# EAGLE schematic PX4FMUlite_V0_4 (EAGLE 6.5.0)

## Sheet 1 of 12
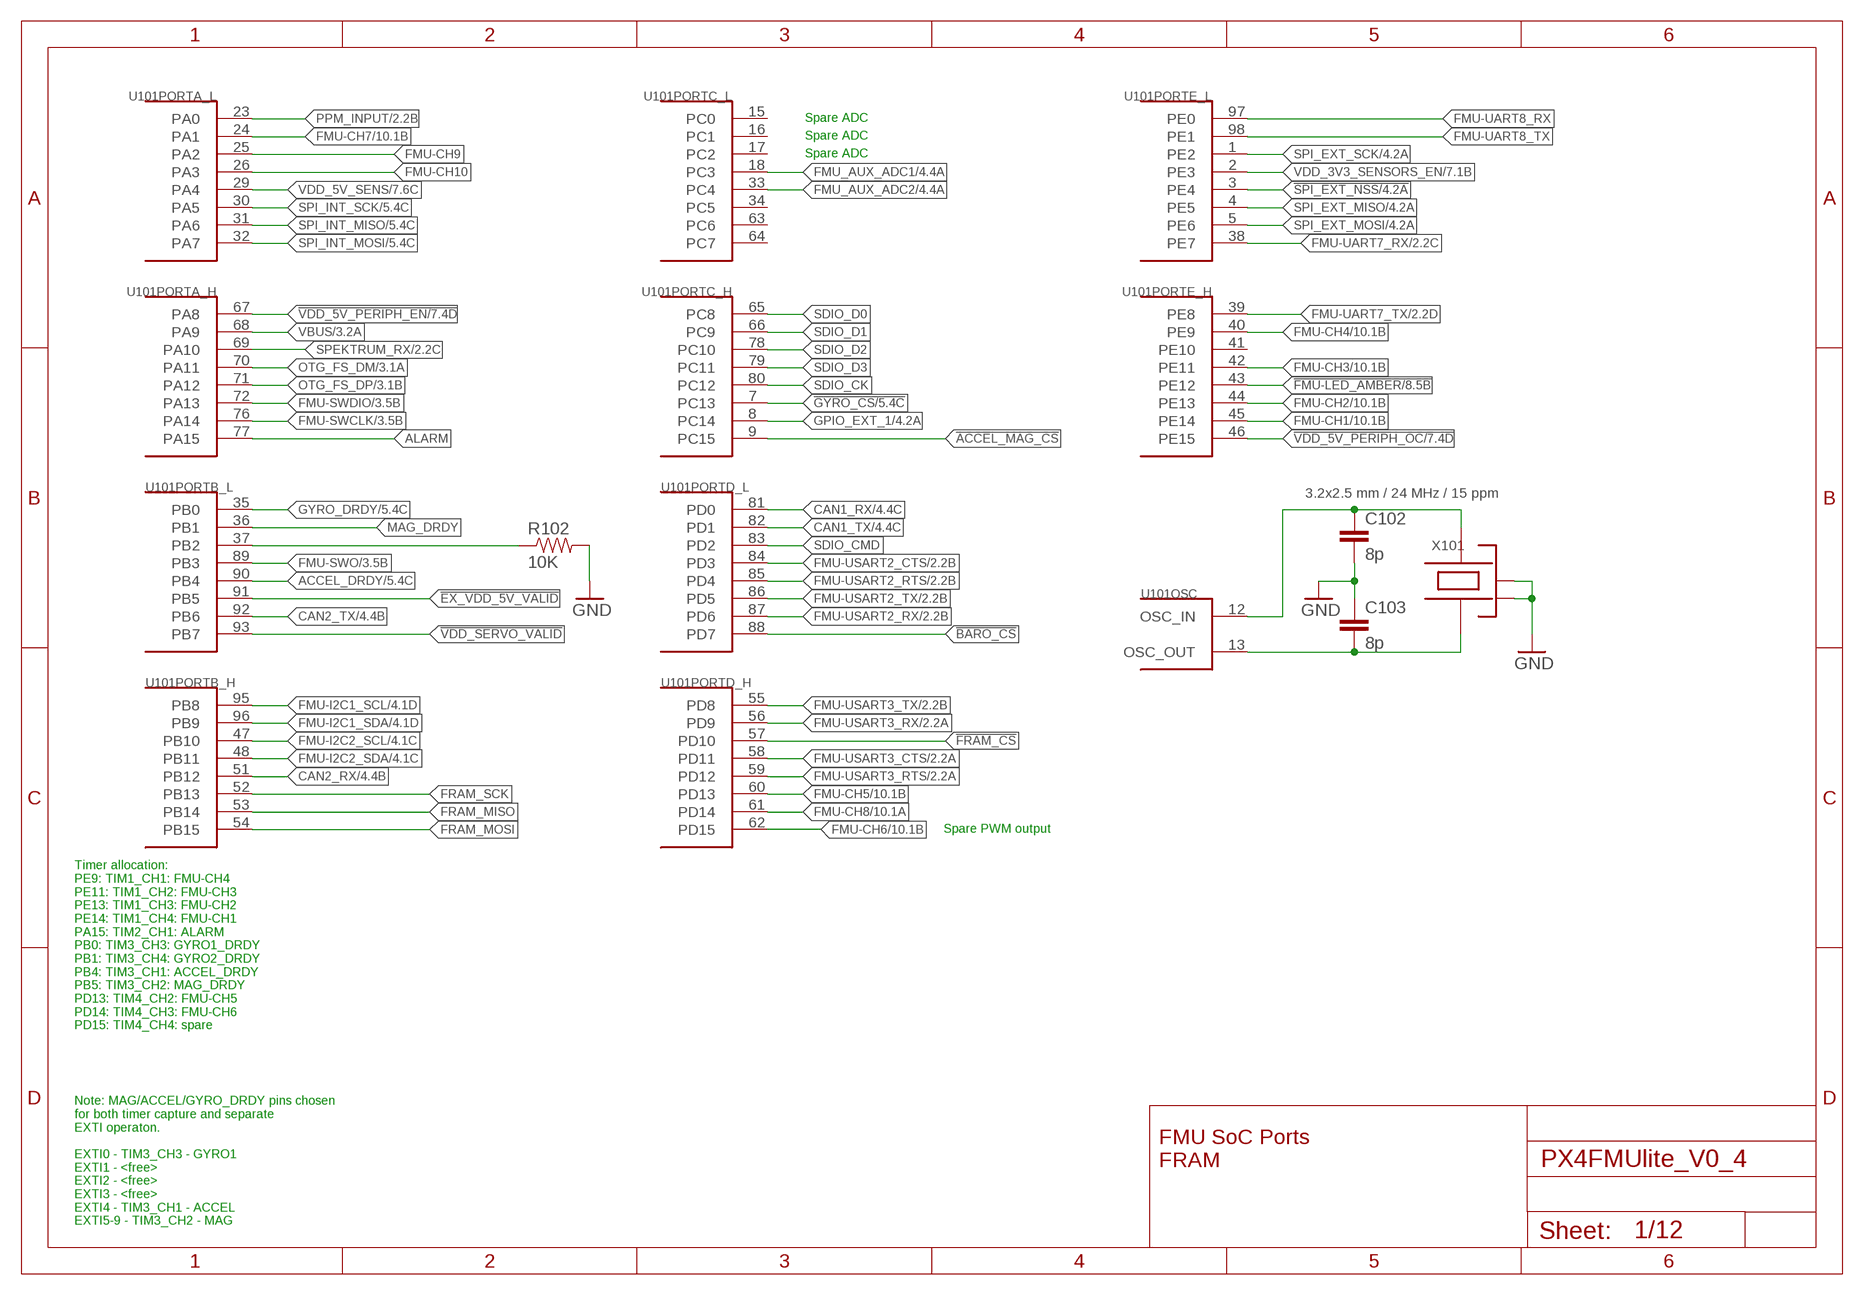
[diagram p0: schematic, sheet 1]

### Parts
C102  8p  CAP0402  [0402-CAP]
C103  8p  CAP0402  [0402-CAP]
R102  10K  RESISTOR0402-RES  [0402-RES]
U101  STM32F4X7VX  [TQFP100]
X101  3.2x2.5 mm / 24 MHz / 15 ppm  OSCILLATOR-3.2X2.5  [OSCILLATOR-3.2X2.5]

### Nets
!ACCEL_MAG_CS: U101.9(PORTC_H:PC15)
!BARO_CS: U101.88(PORTD_L:PD7)
!EX_VDD_5V_VALID: U101.91(PORTB_L:PB5)
!FMU-LED_AMBER: U101.43(PORTE_H:PE12) ; also sheet 8
!FRAM_CS: U101.57(PORTD_H:PD10)
!GYRO_CS: U101.7(PORTC_H:PC13) ; also sheet 5
!SPI_EXT_NSS: U101.3(PORTE_L:PE4) ; also sheet 4
!VDD_5V_PERIPH_EN: U101.67(PORTA_H:PA8) ; also sheet 7
!VDD_5V_PERIPH_OC: U101.46(PORTE_H:PE15) ; also sheet 7
!VDD_SERVO_VALID: U101.93(PORTB_L:PB7)
ACCEL_DRDY: U101.90(PORTB_L:PB4) ; also sheet 5
ALARM: U101.77(PORTA_H:PA15)
CAN1_RX: U101.81(PORTD_L:PD0) ; also sheet 4
CAN1_TX: U101.82(PORTD_L:PD1) ; also sheet 4
CAN2_RX: U101.51(PORTB_H:PB12) ; also sheet 4
CAN2_TX: U101.92(PORTB_L:PB6) ; also sheet 4
FMU-CH1: U101.45(PORTE_H:PE14) ; also sheet 10
FMU-CH2: U101.44(PORTE_H:PE13) ; also sheet 10
FMU-CH3: U101.42(PORTE_H:PE11) ; also sheet 10
FMU-CH4: U101.40(PORTE_H:PE9) ; also sheet 10
FMU-CH5: U101.60(PORTD_H:PD13) ; also sheet 10
FMU-CH6: U101.62(PORTD_H:PD15) ; also sheet 10
FMU-CH7: U101.24(PORTA_L:PA1) ; also sheet 10
FMU-CH8: U101.61(PORTD_H:PD14) ; also sheet 10
FMU-CH9: U101.25(PORTA_L:PA2)
FMU-CH10: U101.26(PORTA_L:PA3)
FMU-I2C1_SCL: U101.95(PORTB_H:PB8) ; also sheet 4
FMU-I2C1_SDA: U101.96(PORTB_H:PB9) ; also sheet 4
FMU-I2C2_SCL: U101.47(PORTB_H:PB10) ; also sheet 4
FMU-I2C2_SDA: U101.48(PORTB_H:PB11) ; also sheet 4
FMU-SWCLK: U101.76(PORTA_H:PA14) ; also sheet 3
FMU-SWDIO: U101.72(PORTA_H:PA13) ; also sheet 3
FMU-SWO: U101.89(PORTB_L:PB3) ; also sheet 3
FMU-UART7_RX: U101.38(PORTE_L:PE7) ; also sheet 2
FMU-UART7_TX: U101.39(PORTE_H:PE8) ; also sheet 2
FMU-UART8_RX: U101.97(PORTE_L:PE0)
FMU-UART8_TX: U101.98(PORTE_L:PE1)
FMU-USART2_CTS: U101.84(PORTD_L:PD3) ; also sheet 2
FMU-USART2_RTS: U101.85(PORTD_L:PD4) ; also sheet 2
FMU-USART2_RX: U101.87(PORTD_L:PD6) ; also sheet 2
FMU-USART2_TX: U101.86(PORTD_L:PD5) ; also sheet 2
FMU-USART3_CTS: U101.58(PORTD_H:PD11) ; also sheet 2
FMU-USART3_RTS: U101.59(PORTD_H:PD12) ; also sheet 2
FMU-USART3_RX: U101.56(PORTD_H:PD9) ; also sheet 2
FMU-USART3_TX: U101.55(PORTD_H:PD8) ; also sheet 2
FMU_AUX_ADC1: U101.18(PORTC_L:PC3) ; also sheet 4
FMU_AUX_ADC2: U101.33(PORTC_L:PC4) ; also sheet 4
FRAM_MISO: U101.53(PORTB_H:PB14)
FRAM_MOSI: U101.54(PORTB_H:PB15)
FRAM_SCK: U101.52(PORTB_H:PB13)
GND [power]: C102.P$2 C103.P$1 R102.P$2 X101.2(NC_2) X101.4(NC_4) ; also sheet 2,3,4,5,6,7,8,9,10
GPIO_EXT_1: U101.8(PORTC_H:PC14) ; also sheet 4
GYRO_DRDY: U101.35(PORTB_L:PB0) ; also sheet 5
MAG_DRDY: U101.36(PORTB_L:PB1)
N$1: C103.P$2 U101.13(OSC:OSC_OUT) X101.1
N$2: C102.P$1 U101.12(OSC:OSC_IN) X101.3
OTG_FS_DM: U101.70(PORTA_H:PA11) ; also sheet 3
OTG_FS_DP: U101.71(PORTA_H:PA12) ; also sheet 3
PB2-BOOT1: R102.P$1 U101.37(PORTB_L:PB2)
PPM_INPUT: U101.23(PORTA_L:PA0) ; also sheet 2
SDIO_CK: U101.80(PORTC_H:PC12) ; also sheet 3
SDIO_CMD: U101.83(PORTD_L:PD2) ; also sheet 3
SDIO_D0: U101.65(PORTC_H:PC8) ; also sheet 3
SDIO_D1: U101.66(PORTC_H:PC9) ; also sheet 3
SDIO_D2: U101.78(PORTC_H:PC10) ; also sheet 3
SDIO_D3: U101.79(PORTC_H:PC11) ; also sheet 3
SPEKTRUM_RX: U101.69(PORTA_H:PA10) ; also sheet 2
SPI_EXT_MISO: U101.4(PORTE_L:PE5) ; also sheet 4
SPI_EXT_MOSI: U101.5(PORTE_L:PE6) ; also sheet 4
SPI_EXT_SCK: U101.1(PORTE_L:PE2) ; also sheet 4
SPI_INT_MISO: U101.31(PORTA_L:PA6) ; also sheet 5
SPI_INT_MOSI: U101.32(PORTA_L:PA7) ; also sheet 5
SPI_INT_SCK: U101.30(PORTA_L:PA5) ; also sheet 5
VBUS [power]: U101.68(PORTA_H:PA9) ; also sheet 3,9
VDD_3V3_SENSORS_EN: U101.2(PORTE_L:PE3) ; also sheet 7
VDD_5V_SENS: U101.29(PORTA_L:PA4) ; also sheet 7
Unconnected: U101.15(PORTC_L:PC0) U101.16(PORTC_L:PC1) U101.17(PORTC_L:PC2) U101.34(PORTC_L:PC5) U101.41(PORTE_H:PE10) U101.63(PORTC_L:PC6) U101.64(PORTC_L:PC7)

### Notes on the sheet
- Spare ADC
- Spare ADC
- Spare ADC
- Spare PWM output
- Timer allocation:
  PE9: TIM1_CH1: FMU-CH4
  PE11: TIM1_CH2: FMU-CH3
  PE13: TIM1_CH3: FMU-CH2
  PE14: TIM1_CH4: FMU-CH1
  PA15: TIM2_CH1: ALARM
  PB0: TIM3_CH3: GYRO1_DRDY
  PB1: TIM3_CH4: GYRO2_DRDY
  PB4: TIM3_CH1: ACCEL_DRDY
  PB5: TIM3_CH2: MAG_DRDY
  PD13: TIM4_CH2: FMU-CH5
  PD14: TIM4_CH3: FMU-CH6
  PD15: TIM4_CH4: spare
- FMU SoC Ports
  FRAM
- Note: MAG/ACCEL/GYRO_DRDY pins chosen
  for both timer capture and separate
  EXTI operaton.
  
  EXTI0 - TIM3_CH3 - GYRO1
  EXTI1 - <free>
  EXTI2 - <free>
  EXTI3 - <free>
  EXTI4 - TIM3_CH1 - ACCEL
  EXTI5-9 - TIM3_CH2 - MAG

## Sheet 2 of 12
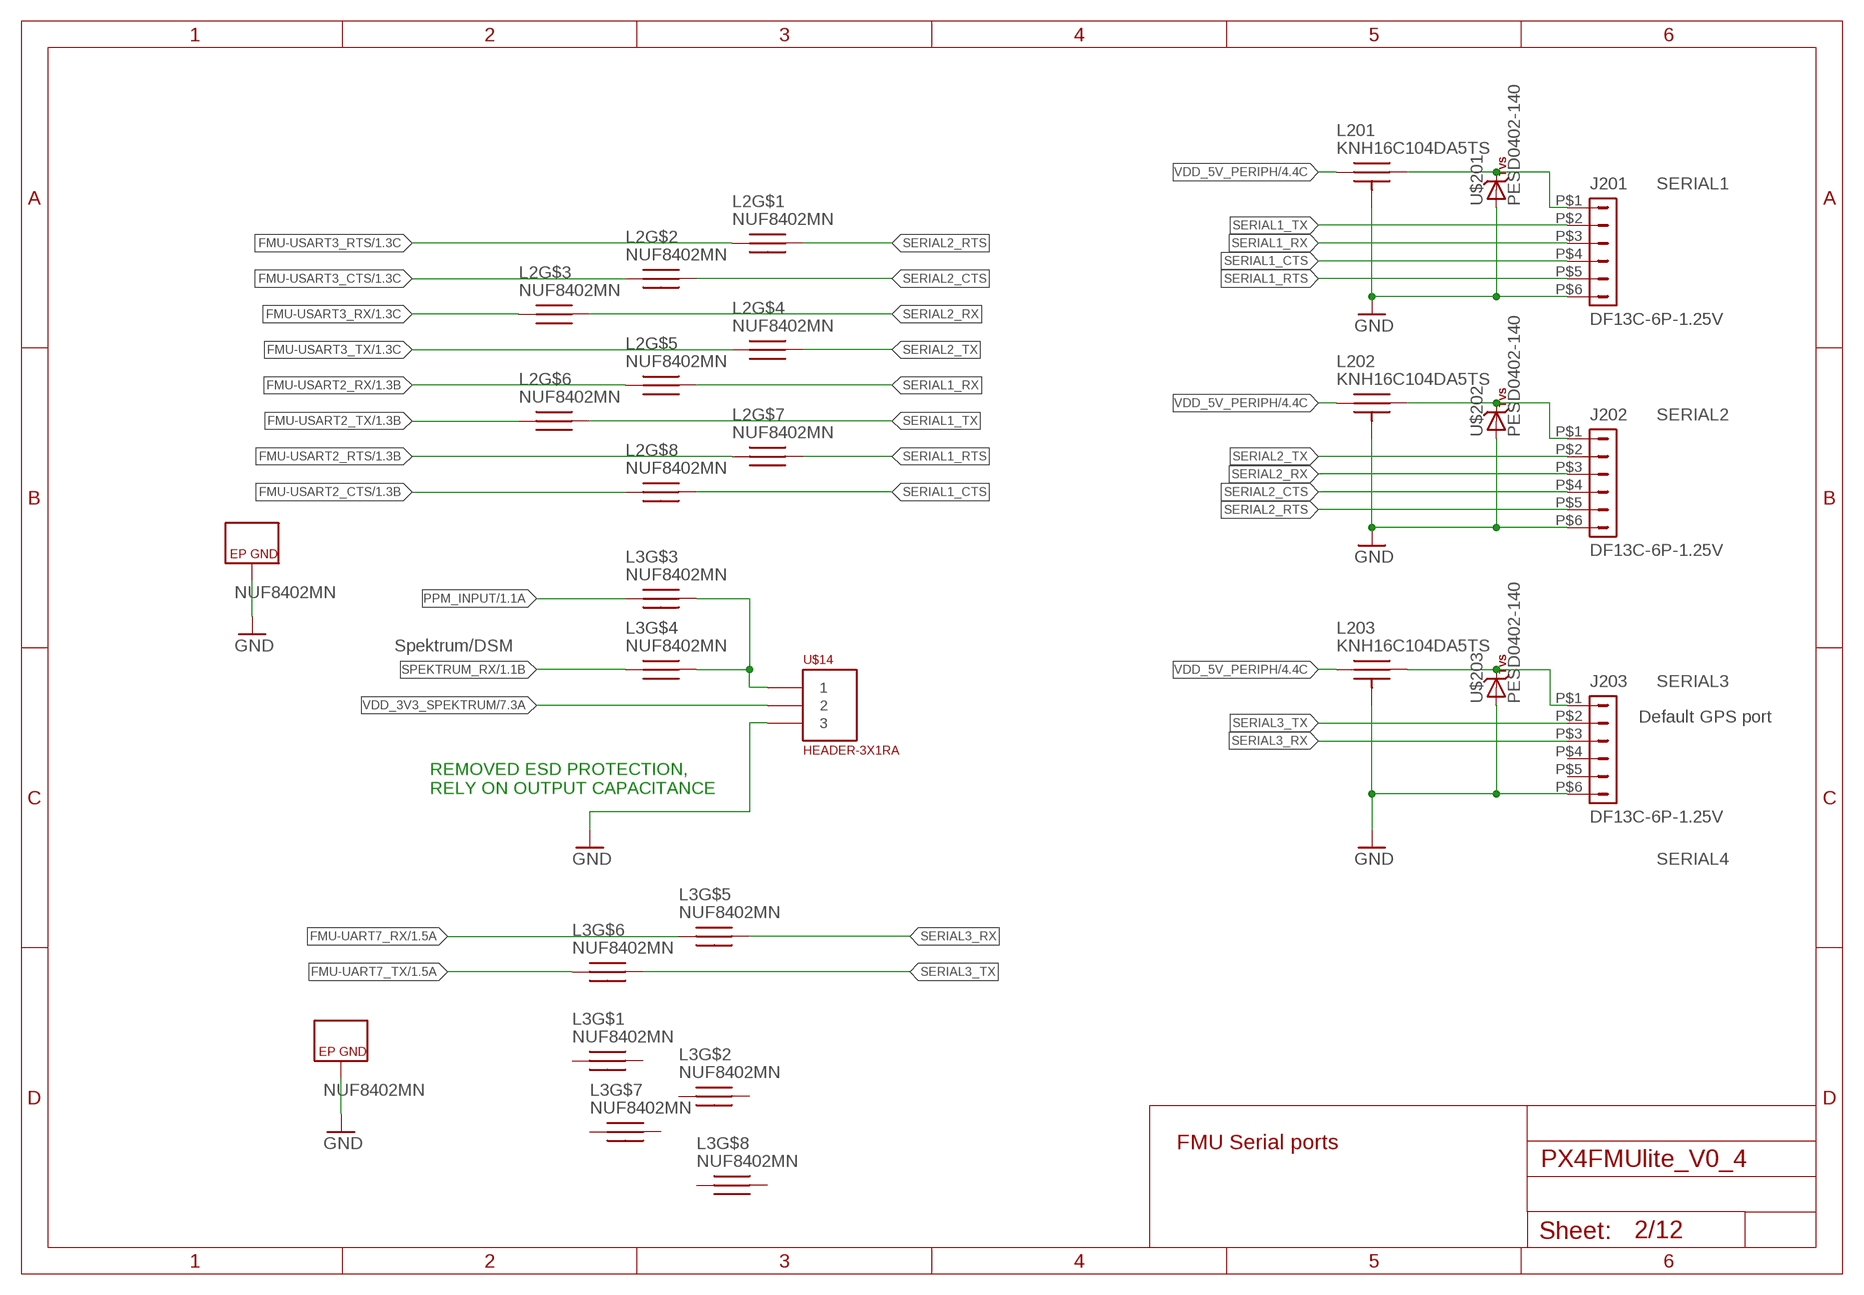
[diagram p1: schematic, sheet 2]

### Parts
J201  DF13C-6P-1.25V  DF13-6P-1.25V  [DF13C-6P-1.25V]
J202  DF13C-6P-1.25V  DF13-6P-1.25V  [DF13C-6P-1.25V]
J203  DF13C-6P-1.25V  DF13-6P-1.25V  [DF13C-6P-1.25V]
L2  NUF8402MN  [DFN16-THIN]
L3  NUF8402MN  [DFN16-THIN]
L201  KNH16C104DA5TS  [KYOCERA-KNH16-DA]
L202  KNH16C104DA5TS  [KYOCERA-KNH16-DA]
L203  KNH16C104DA5TS  [KYOCERA-KNH16-DA]
U$14  HEADER-3X1RA  [3X1RA]
U$201  PESD0402-140  DIODE-TVS  [0402-TVS]
U$202  PESD0402-140  DIODE-TVS  [0402-TVS]
U$203  PESD0402-140  DIODE-TVS  [0402-TVS]

### Nets
5V_S1_FILTERED [power]: J201.P$1 L201.P$2 U$201.C
5V_S2_FILTERED [power]: J202.P$1 L202.P$2 U$202.C
5V_S3_FILTERED [power]: J203.P$1 L203.P$2 U$203.C
FMU-UART7_RX: L3.P$5 ; also sheet 1
FMU-UART7_TX: L3.P$6 ; also sheet 1
FMU-USART2_CTS: L2.P$8 ; also sheet 1
FMU-USART2_RTS: L2.P$7 ; also sheet 1
FMU-USART2_RX: L2.P$5 ; also sheet 1
FMU-USART2_TX: L2.P$6 ; also sheet 1
FMU-USART3_CTS: L2.P$2 ; also sheet 1
FMU-USART3_RTS: L2.P$1 ; also sheet 1
FMU-USART3_RX: L2.P$3 ; also sheet 1
FMU-USART3_TX: L2.P$4 ; also sheet 1
GND [power]: J201.P$6 J202.P$6 J203.P$6 L2.P$EP(GND) L3.P$EP(GND) L201.P$3 L201.P$4 L201.P$5 L202.P$3 L202.P$4 L202.P$5 L203.P$3 L203.P$4 L203.P$5 U$14.3 U$201.A U$202.A U$203.A ; also sheet 1,3,4,5,6,7,8,9,10
N$18: L3.P$13 L3.P$14 U$14.1
PPM_INPUT: L3.P$3 ; also sheet 1
SERIAL1_CTS: J201.P$4 L2.P$9
SERIAL1_RTS: J201.P$5 L2.P$10
SERIAL1_RX: J201.P$3 L2.P$12
SERIAL1_TX: J201.P$2 L2.P$11
SERIAL2_CTS: J202.P$4 L2.P$15
SERIAL2_RTS: J202.P$5 L2.P$16
SERIAL2_RX: J202.P$3 L2.P$14
SERIAL2_TX: J202.P$2 L2.P$13
SERIAL3_RX: J203.P$3 L3.P$12
SERIAL3_TX: J203.P$2 L3.P$11
SPEKTRUM_RX: L3.P$4 ; also sheet 1
VDD_3V3_SPEKTRUM [power]: U$14.2 ; also sheet 7
VDD_5V_PERIPH [power]: L201.P$1 L202.P$1 L203.P$1 ; also sheet 4,7
Unconnected: J203.P$4 J203.P$5 L3.P$1 L3.P$2 L3.P$7 L3.P$8 L3.P$9 L3.P$10 L3.P$15 L3.P$16

### Notes on the sheet
- SERIAL1
- SERIAL2
- Spektrum/DSM
- SERIAL3
- Default GPS port
- REMOVED ESD PROTECTION, 
  RELY ON OUTPUT CAPACITANCE
- SERIAL4
- FMU Serial ports

## Sheet 3 of 12
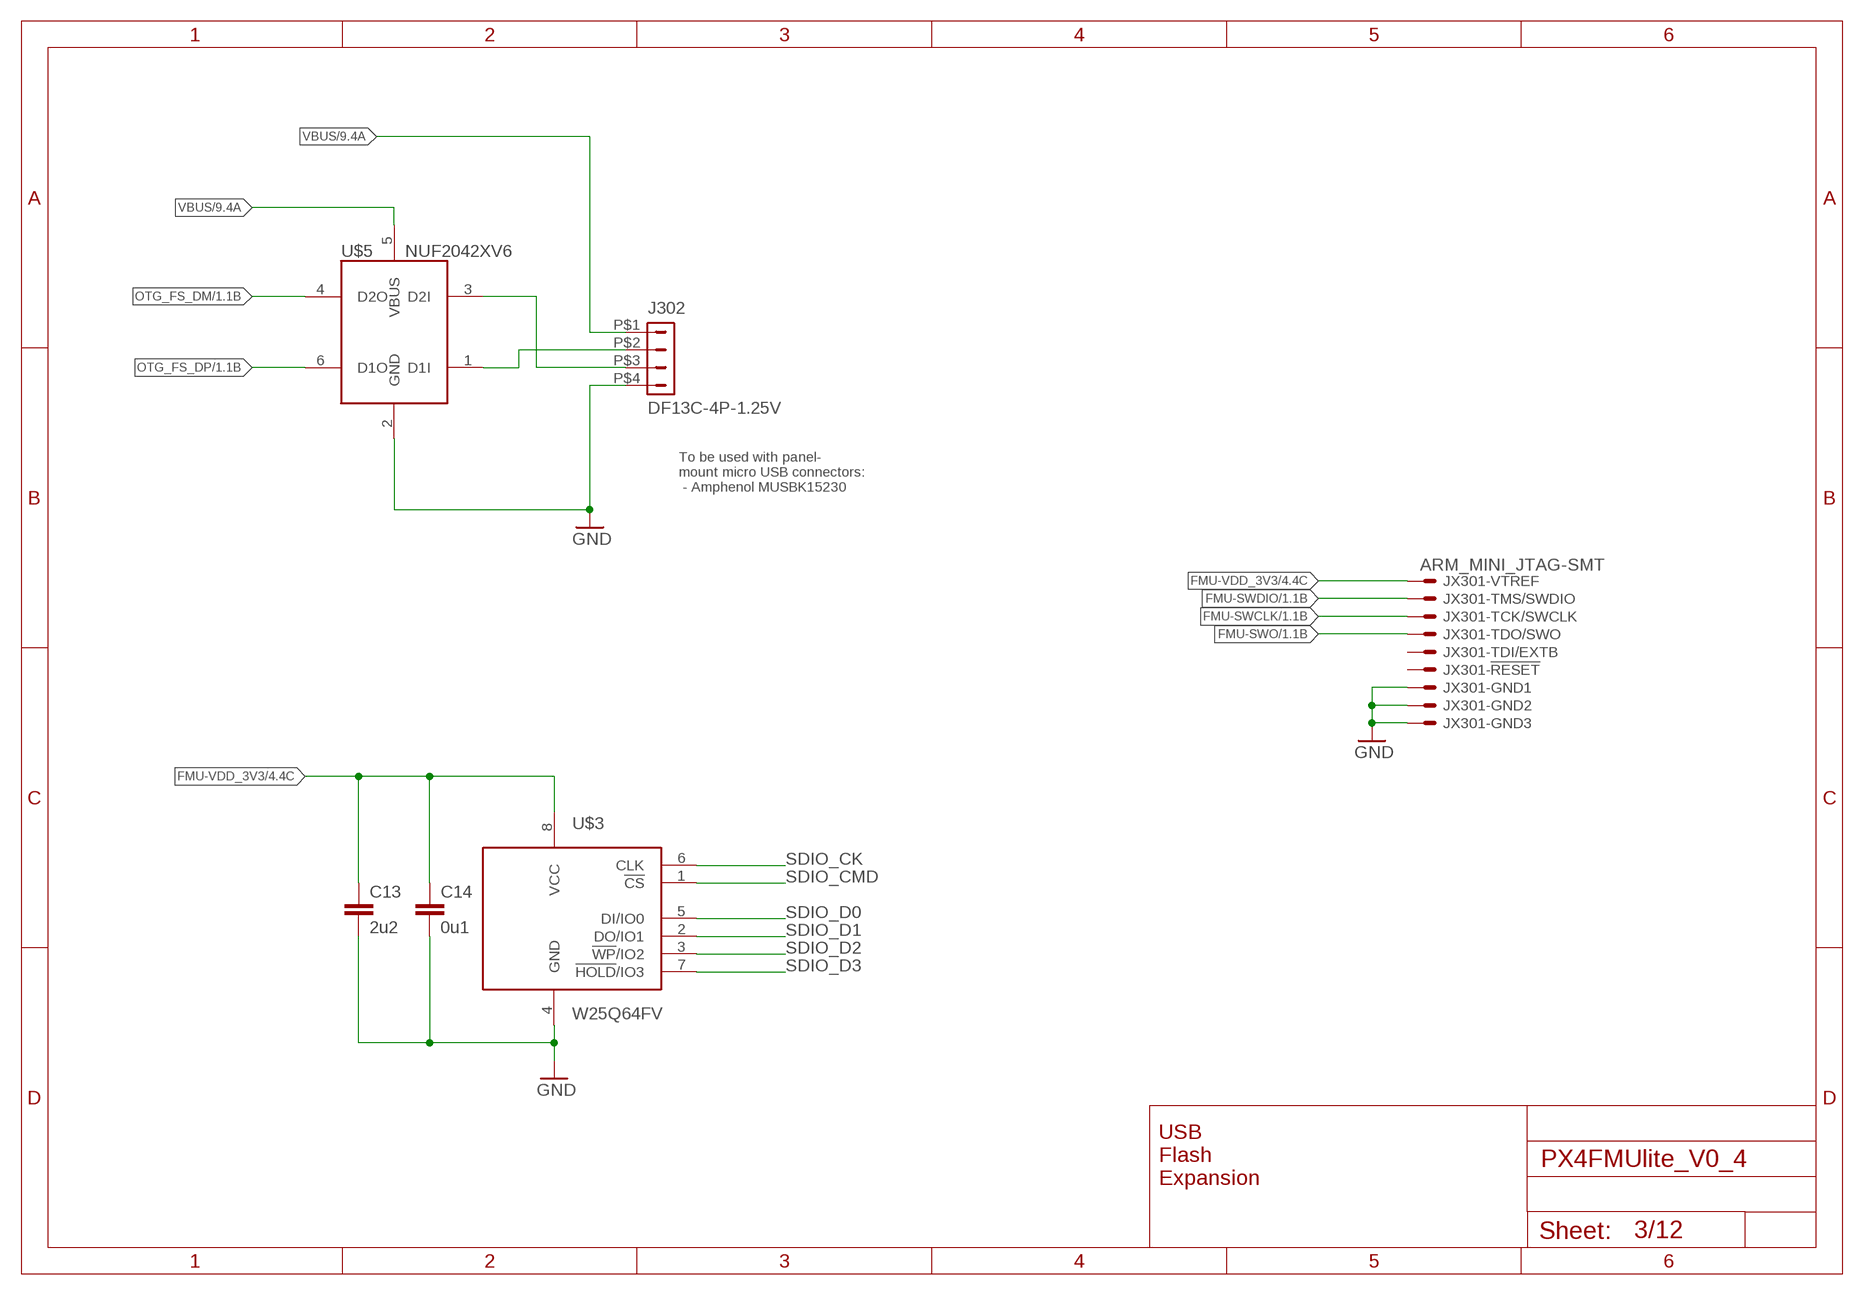
[diagram p2: schematic, sheet 3]

### Parts
C13  2u2  CAP0603  [0603-CAP]
C14  0u1  CAP0402  [0402-CAP]
J302  DF13C-4P-1.25V  DF13-4P-1.25V  [DF13C-4P-1.25V]
JX301  ARM_MINI_JTAG-SMT  [FTSH-105-01-XXX-DV-K]
U$3  W25Q64FV  [WSON-8-5X6]
U$5  NUF2042XV6  [SOT563-6]

### Nets
FMU-SWCLK: JX301.4 ; also sheet 1
FMU-SWDIO: JX301.2 ; also sheet 1
FMU-SWO: JX301.6 ; also sheet 1
FMU-VDD_3V3 [power]: C13.P$1 C14.P$1 JX301.1 U$3.8(VCC) ; also sheet 4,7,8
GND [power]: C13.P$2 C14.P$2 J302.P$4 JX301.3 JX301.5 JX301.9 U$3.4(GND) U$5.2(GND) ; also sheet 1,2,4,5,6,7,8,9,10
OTG_DM1: J302.P$3 U$5.3(D2I)
OTG_DP1: J302.P$2 U$5.1(D1I)
OTG_FS_DM: U$5.4(D2O) ; also sheet 1
OTG_FS_DP: U$5.6(D1O) ; also sheet 1
SDIO_CK: U$3.6(CLK) ; also sheet 1
SDIO_CMD: U$3.1(!CS) ; also sheet 1
SDIO_D0: U$3.5(DI/IO0) ; also sheet 1
SDIO_D1: U$3.2(DO/IO1) ; also sheet 1
SDIO_D2: U$3.3(!WP!/IO2) ; also sheet 1
SDIO_D3: U$3.7(!HOLD!/IO3) ; also sheet 1
VBUS [power]: J302.P$1 U$5.5(VBUS) ; also sheet 1,9
Unconnected: JX301.8 JX301.10

### Notes on the sheet
- To be used with panel-
  mount micro USB connectors:
   - Amphenol MUSBK15230
- USB
  Flash
  Expansion

## Sheet 4 of 12
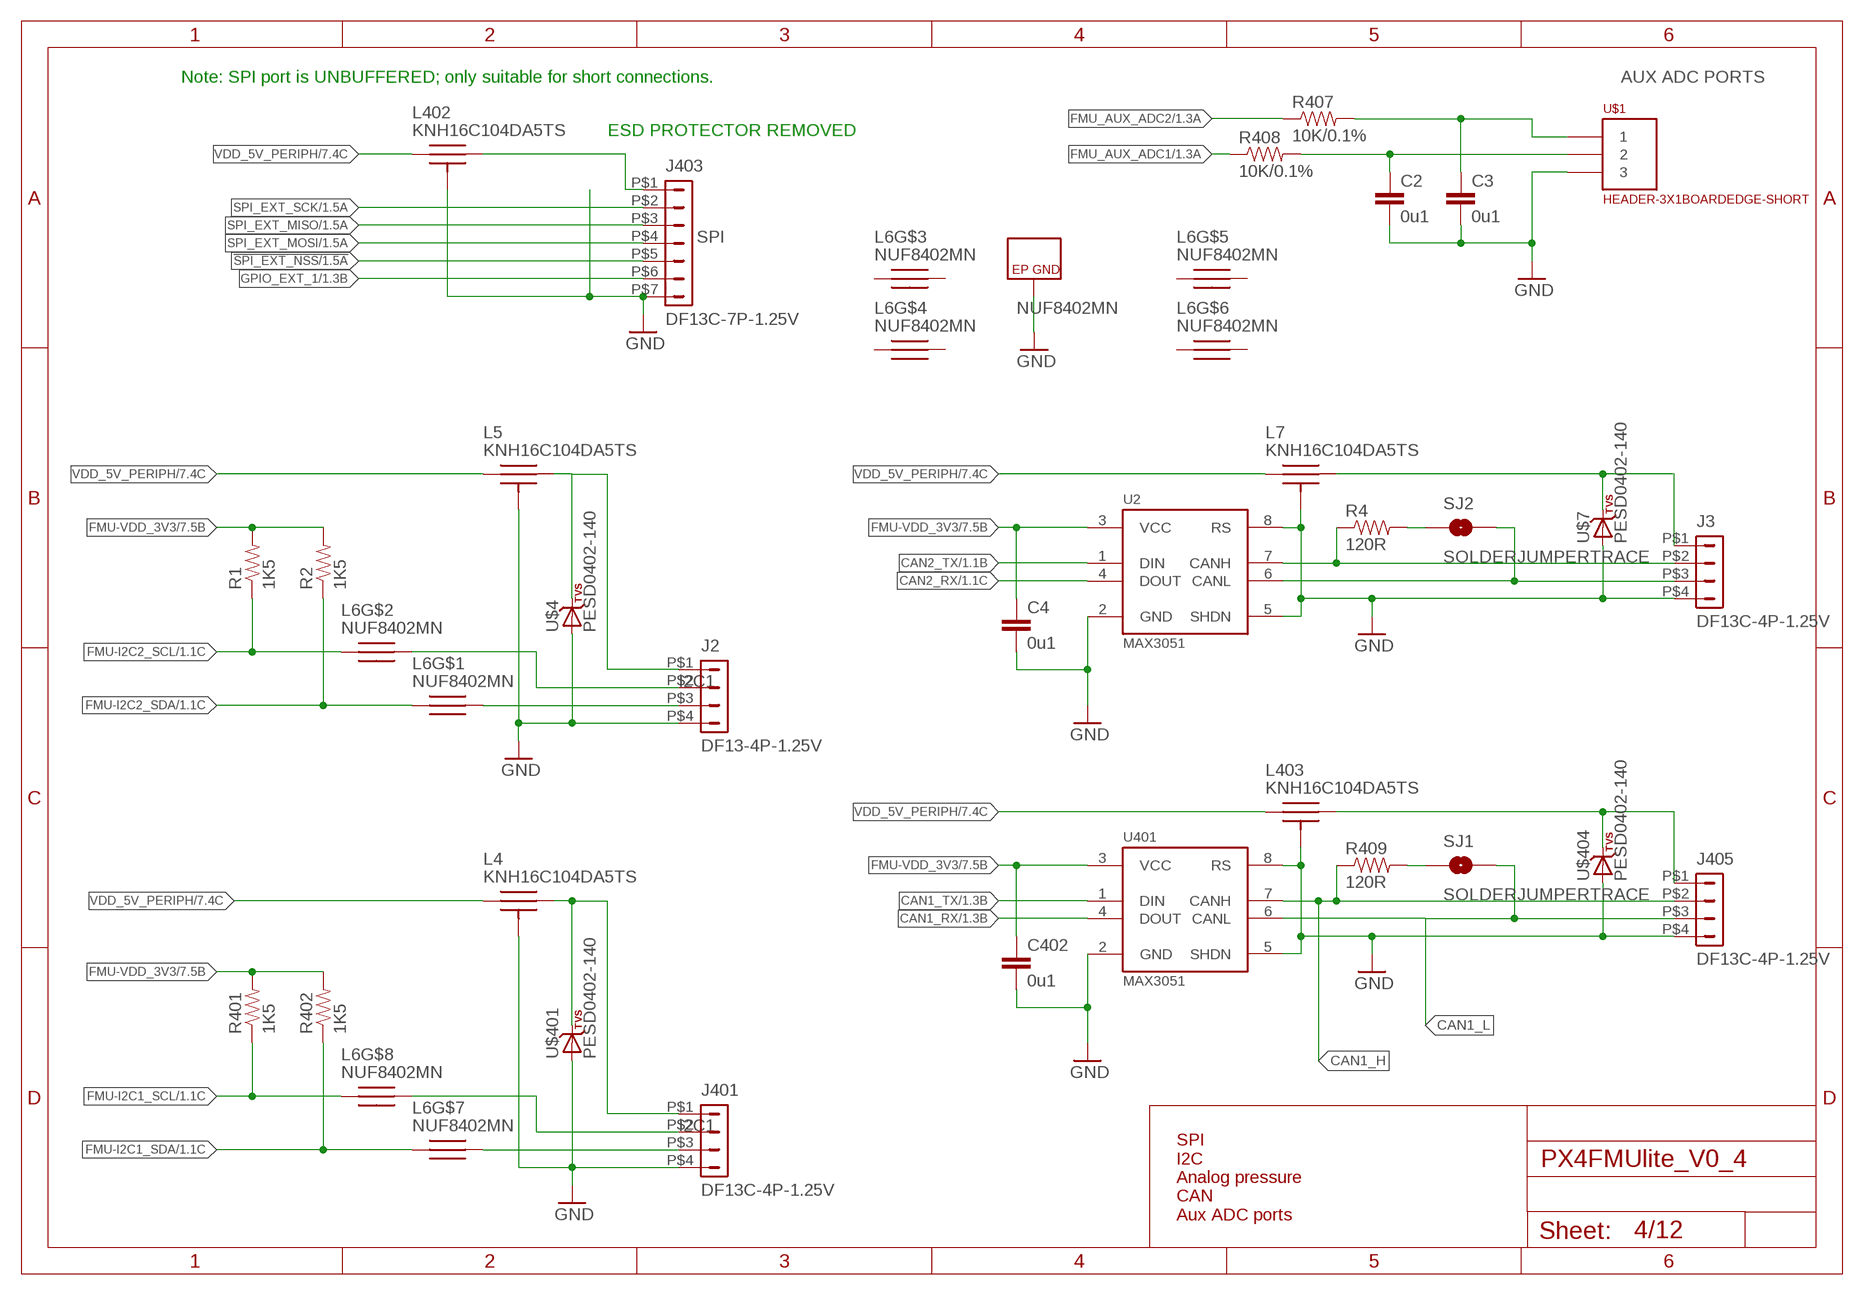
[diagram p3: schematic, sheet 4]

### Parts
C2  0u1  CAP0402  [0402-CAP]
C3  0u1  CAP0402  [0402-CAP]
C4  0u1  CAP0402  [0402-CAP]
C402  0u1  CAP0402  [0402-CAP]
J2  DF13-4P-1.25V  [DF13C-4P-1.25V]
J3  DF13C-4P-1.25V  DF13-4P-1.25V  [DF13C-4P-1.25V]
J401  DF13C-4P-1.25V  DF13-4P-1.25V  [DF13C-4P-1.25V]
J403  DF13C-7P-1.25V  DF13-7P-1.25V  [DF13C-7P-1.25V]
J405  DF13C-4P-1.25V  DF13-4P-1.25V  [DF13C-4P-1.25V]
L4  KNH16C104DA5TS  [KYOCERA-KNH16-DA]
L5  KNH16C104DA5TS  [KYOCERA-KNH16-DA]
L6  NUF8402MN  [DFN16-THIN]
L7  KNH16C104DA5TS  [KYOCERA-KNH16-DA]
L402  KNH16C104DA5TS  [KYOCERA-KNH16-DA]
L403  KNH16C104DA5TS  [KYOCERA-KNH16-DA]
R1  1K5  RESISTOR0402-RES  [0402-RES]
R2  1K5  RESISTOR0402-RES  [0402-RES]
R4  120R  RESISTOR0402-RES  [0402-RES]
R401  1K5  RESISTOR0402-RES  [0402-RES]
R402  1K5  RESISTOR0402-RES  [0402-RES]
R407  10K/0.1%  RESISTOR0402-RES  [0402-RES]
R408  10K/0.1%  RESISTOR0402-RES  [0402-RES]
R409  120R  RESISTOR0402-RES  [0402-RES]
SJ1  SOLDERJUMPERTRACE  [SJ_2S-TRACE]
SJ2  SOLDERJUMPERTRACE  [SJ_2S-TRACE]
U2  MAX3051  MAX3051MAX3051EKA  [SOT23-8]
U401  MAX3051  MAX3051MAX3051EKA  [SOT23-8]
U$1  HEADER-3X1BOARDEDGE-SHORT  [HEADER_3X01_SMD_H_BOARD_EDGE_SHORT]
U$4  PESD0402-140  DIODE-TVS  [0402-TVS]
U$7  PESD0402-140  DIODE-TVS  [0402-TVS]
U$401  PESD0402-140  DIODE-TVS  [0402-TVS]
U$404  PESD0402-140  DIODE-TVS  [0402-TVS]

### Nets
!SPI_EXT_NSS: J403.P$5 ; also sheet 1
CAN1_H: J405.P$2 R409.P$1 U401.7(CANH)
CAN1_L: J405.P$3 SJ1.2 U401.6(CANL)
CAN1_RX: U401.4(DOUT) ; also sheet 1
CAN1_TX: U401.1(DIN) ; also sheet 1
CAN2_H: J3.P$2 R4.P$1 U2.7(CANH)
CAN2_L: J3.P$3 SJ2.2 U2.6(CANL)
CAN2_RX: U2.4(DOUT) ; also sheet 1
CAN2_TX: U2.1(DIN) ; also sheet 1
FMU-I2C1_SCL: L6.P$8 R401.P$1 ; also sheet 1
FMU-I2C1_SDA: L6.P$7 R402.P$1 ; also sheet 1
FMU-I2C2_SCL: L6.P$2 R1.P$1 ; also sheet 1
FMU-I2C2_SDA: L6.P$1 R2.P$1 ; also sheet 1
FMU-VDD_3V3 [power]: C4.P$1 C402.P$1 R1.P$2 R2.P$2 R401.P$2 R402.P$2 U2.3(VCC) U401.3(VCC) ; also sheet 3,7,8
FMU_AUX_ADC1: R408.P$1 ; also sheet 1
FMU_AUX_ADC1_PROT: C2.P$1 R408.P$2 U$1.2
FMU_AUX_ADC2: R407.P$1 ; also sheet 1
FMU_AUX_ADC2_PROT: C3.P$1 R407.P$2 U$1.1
GND [power]: C2.P$2 C3.P$2 C4.P$2 C402.P$2 J2.P$4 J3.P$4 J401.P$4 J403.P$7 J405.P$4 L4.P$3 L4.P$4 L4.P$5 L5.P$3 L5.P$4 L5.P$5 L6.P$EP(GND) L7.P$3 L7.P$4 L7.P$5 L402.P$3 L402.P$4 L402.P$5 L403.P$3 L403.P$4 L403.P$5 U2.2(GND) U2.5(SHDN) U2.8(RS) U401.2(GND) U401.5(SHDN) U401.8(RS) U$1.3 U$4.A U$7.A U$401.A U$404.A ; also sheet 1,2,3,5,6,7,8,9,10
GPIO_EXT_1: J403.P$6 ; also sheet 1
N$4: J2.P$2 L6.P$15
N$20: J2.P$3 L6.P$16
N$21 [power]: J2.P$1 L5.P$2 U$4.C
N$22: R409.P$2 SJ1.1
N$28 [power]: J3.P$1 L7.P$2 U$7.C
N$29: R4.P$2 SJ2.1
N$33: J401.P$2 L6.P$9
N$37: J401.P$3 L6.P$10
N$41 [power]: J403.P$1 L402.P$2
N$42 [power]: J401.P$1 L4.P$2 U$401.C
N$48 [power]: J405.P$1 L403.P$2 U$404.C
SPI_EXT_MISO: J403.P$3 ; also sheet 1
SPI_EXT_MOSI: J403.P$4 ; also sheet 1
SPI_EXT_SCK: J403.P$2 ; also sheet 1
VDD_5V_PERIPH [power]: L4.P$1 L5.P$1 L7.P$1 L402.P$1 L403.P$1 ; also sheet 2,7
Unconnected: L6.P$3 L6.P$4 L6.P$5 L6.P$6 L6.P$11 L6.P$12 L6.P$13 L6.P$14

### Notes on the sheet
- Note: SPI port is UNBUFFERED; only suitable for short connections. | AUX ADC PORTS
- ESD PROTECTOR REMOVED
- SPI
- I2C1
- I2C1
- SPI
  I2C
  Analog pressure
  CAN
  Aux ADC ports

## Sheet 5 of 12
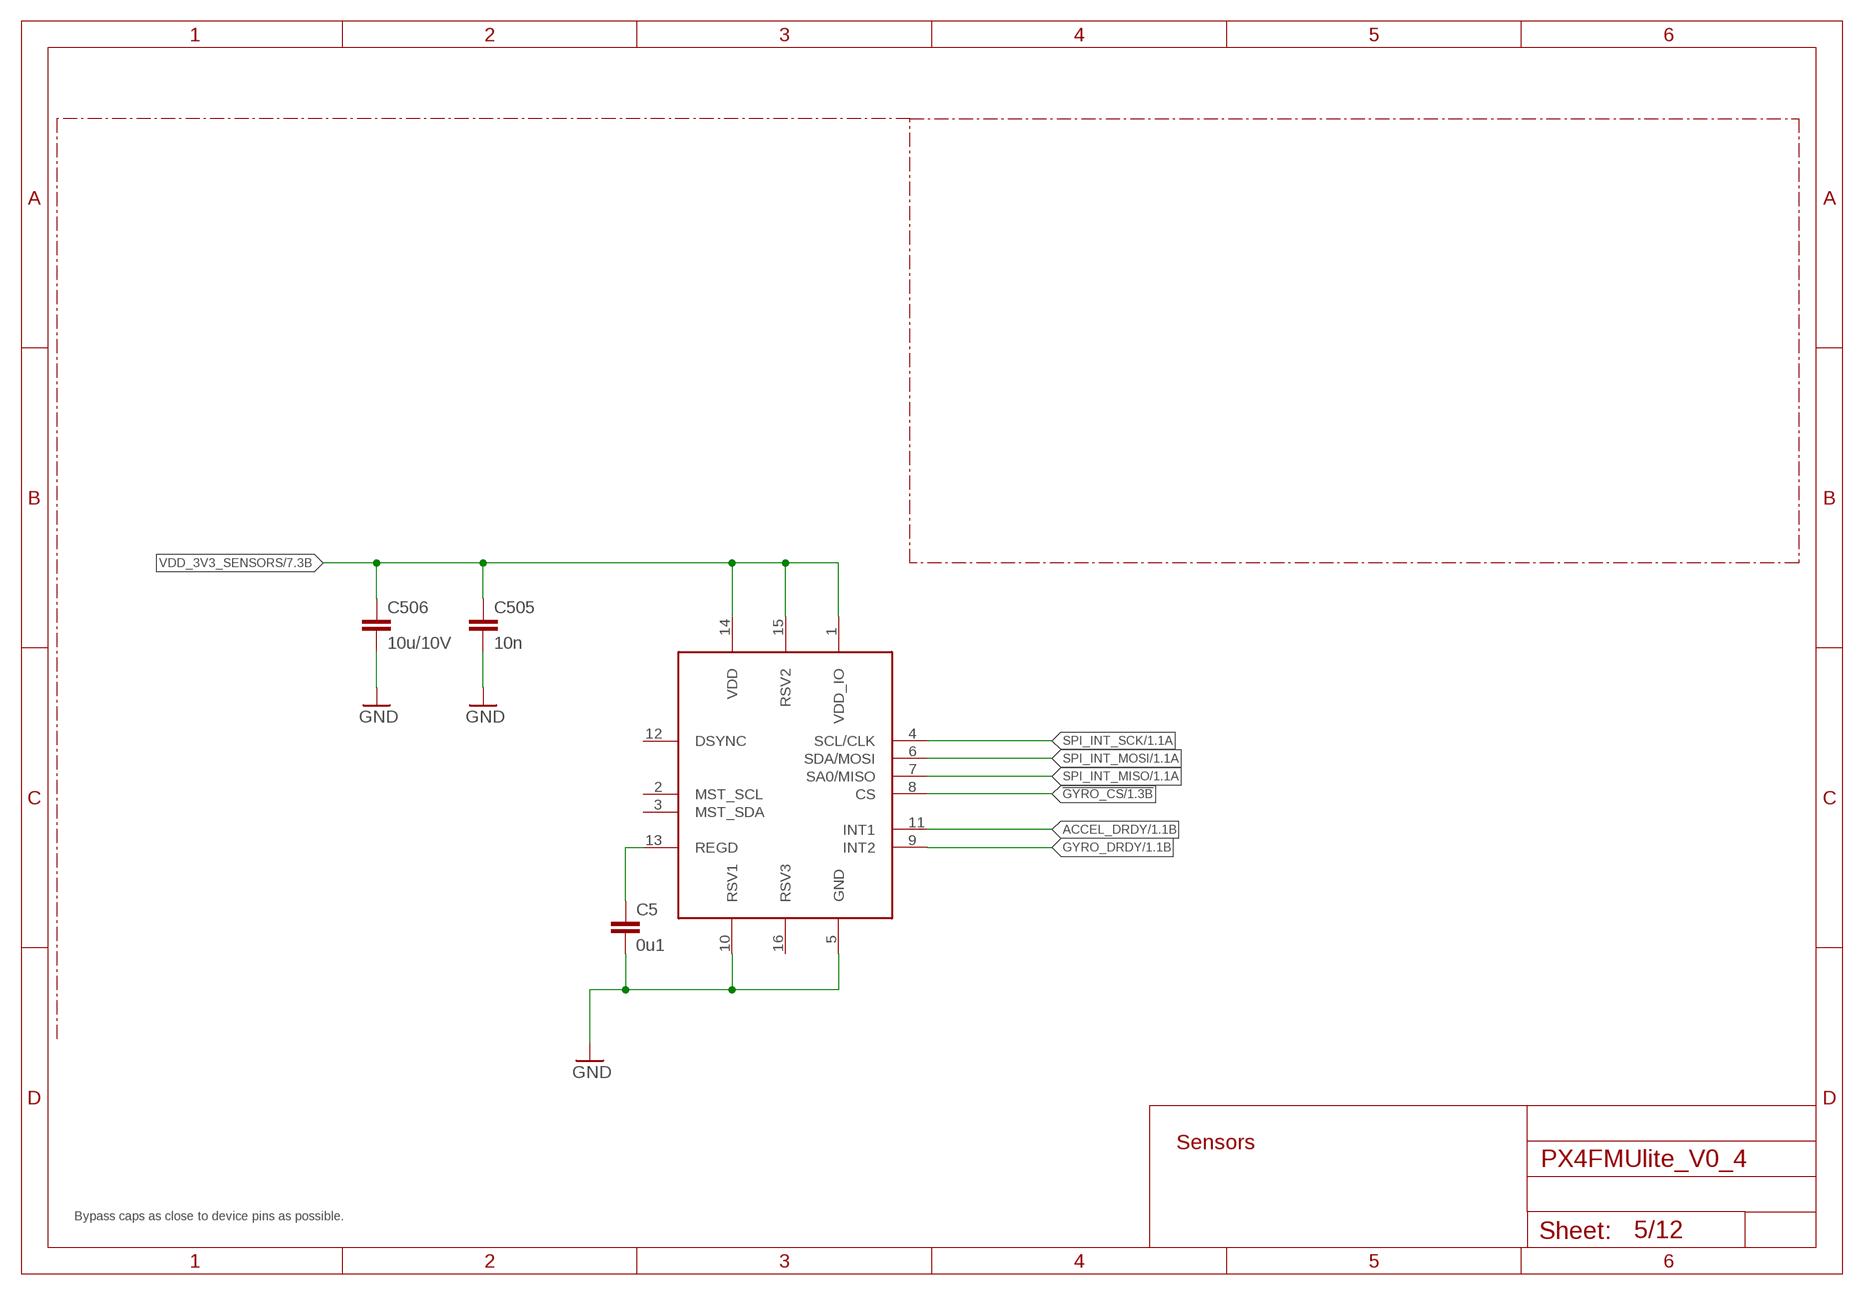
[diagram p4: schematic, sheet 5]

### Parts
C5  0u1  CAP0402  [0402-CAP]
C505  10n  CAP0402  [0402-CAP]
C506  10u/10V  CAP0805  [0805-CAP]
U$2  MAX21100  [16LGA-3X3]

### Nets
!GYRO_CS: U$2.8(CS) ; also sheet 1
ACCEL_DRDY: U$2.11(INT1) ; also sheet 1
GND [power]: C5.P$2 C505.P$2 C506.P$2 U$2.5(GND) U$2.10(RSV1) ; also sheet 1,2,3,4,6,7,8,9,10
GYRO_DRDY: U$2.9(INT2) ; also sheet 1
REGD: C5.P$1 U$2.13(REGD)
SPI_INT_MISO: U$2.7(SA0/MISO) ; also sheet 1
SPI_INT_MOSI: U$2.6(SDA/MOSI) ; also sheet 1
SPI_INT_SCK: U$2.4(SCL/CLK) ; also sheet 1
VDD_3V3_SENSORS [power]: C505.P$1 C506.P$1 U$2.1(VDD_IO) U$2.14(VDD) U$2.15(RSV2) ; also sheet 7
Unconnected: U$2.2(MST_SCL) U$2.3(MST_SDA) U$2.12(DSYNC) U$2.16(RSV3)

### Notes on the sheet
- Sensors
- Bypass caps as close to device pins as possible.

## Sheet 6 of 12
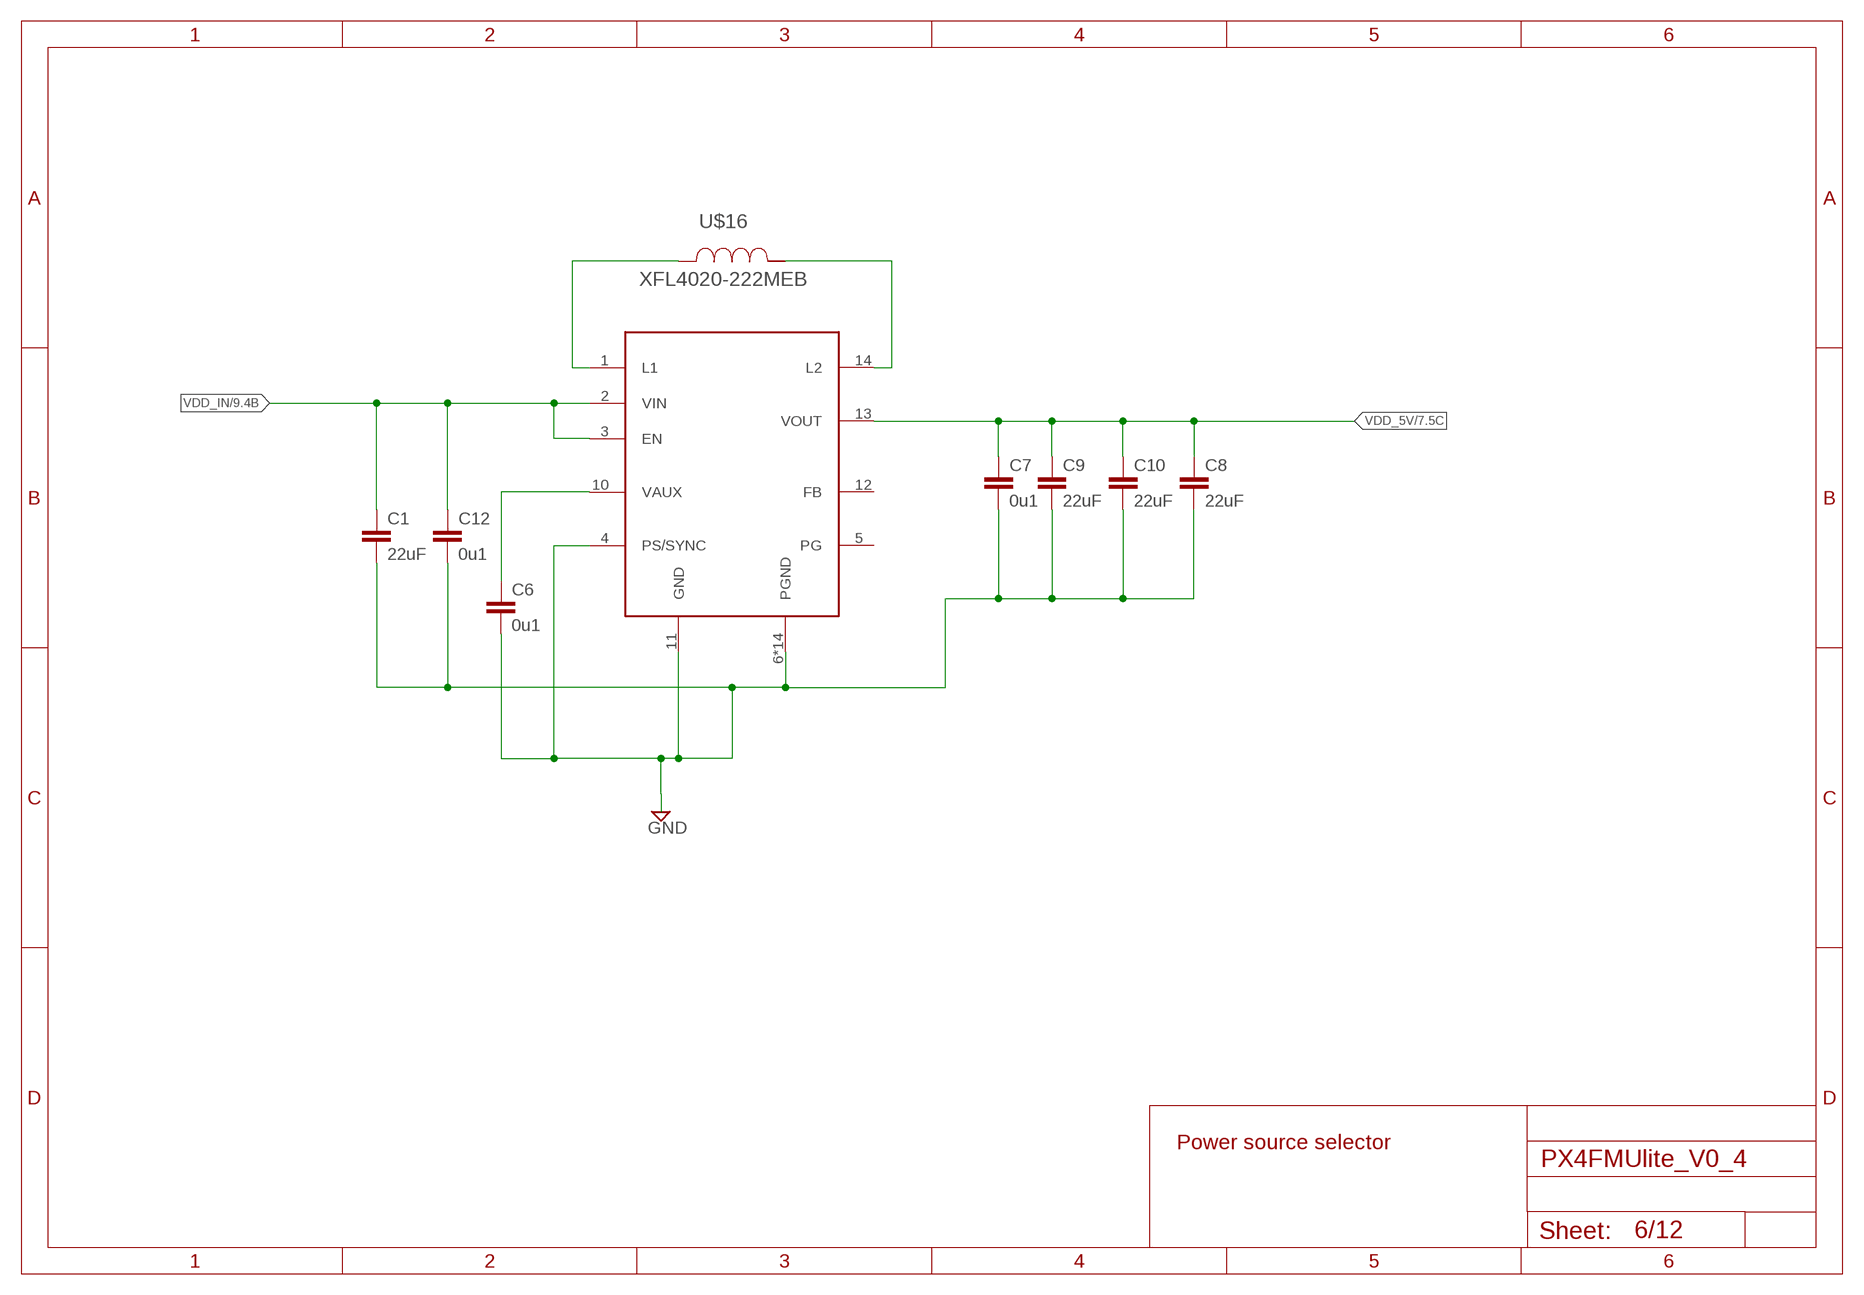
[diagram p5: schematic, sheet 6]

### Parts
C1  22uF  22UF-16V-20%-(1210)  [1210]
C6  0u1  CAP0402  [0402-CAP]
C7  0u1  CAP0402  [0402-CAP]
C8  22uF  22UF-16V-20%-(1210)  [1210]
C9  22uF  22UF-16V-20%-(1210)  [1210]
C10  22uF  22UF-16V-20%-(1210)  [1210]
C12  0u1  CAP0402  [0402-CAP]
U$15  TPS6303X  [PWSON10]
U$16  XFL4020-222MEB  [XFL4020]

### Nets
GND [power]: C1.2 C6.P$2 C7.P$2 C8.2 C9.2 C10.2 C12.P$2 U$15.4(PS/SYNC) U$15.6(PGND) U$15.7(PGND) U$15.8(PGND) U$15.9(PGND) U$15.11(GND) U$15.15(PGND) U$15.16(PGND) U$15.17(PGND) U$15.18(PGND) U$15.19(PGND) U$15.20(PGND) U$15.21(PGND) U$15.22(PGND) U$15.23(PGND) U$15.EP(PGND) ; also sheet 1,2,3,4,5,7,8,9,10
N$10: U$15.14(L2) U$16.1
N$17: U$15.1(L1) U$16.2
N$27: C6.P$1 U$15.10(VAUX)
VDD_5V [power]: C7.P$1 C8.1 C9.1 C10.1 U$15.13(VOUT) ; also sheet 7,8
VDD_IN [power]: C1.1 C12.P$1 U$15.2(VIN) U$15.3(EN) ; also sheet 9
Unconnected: U$15.5(PG) U$15.12(FB)

### Notes on the sheet
- Power source selector

## Sheet 7 of 12
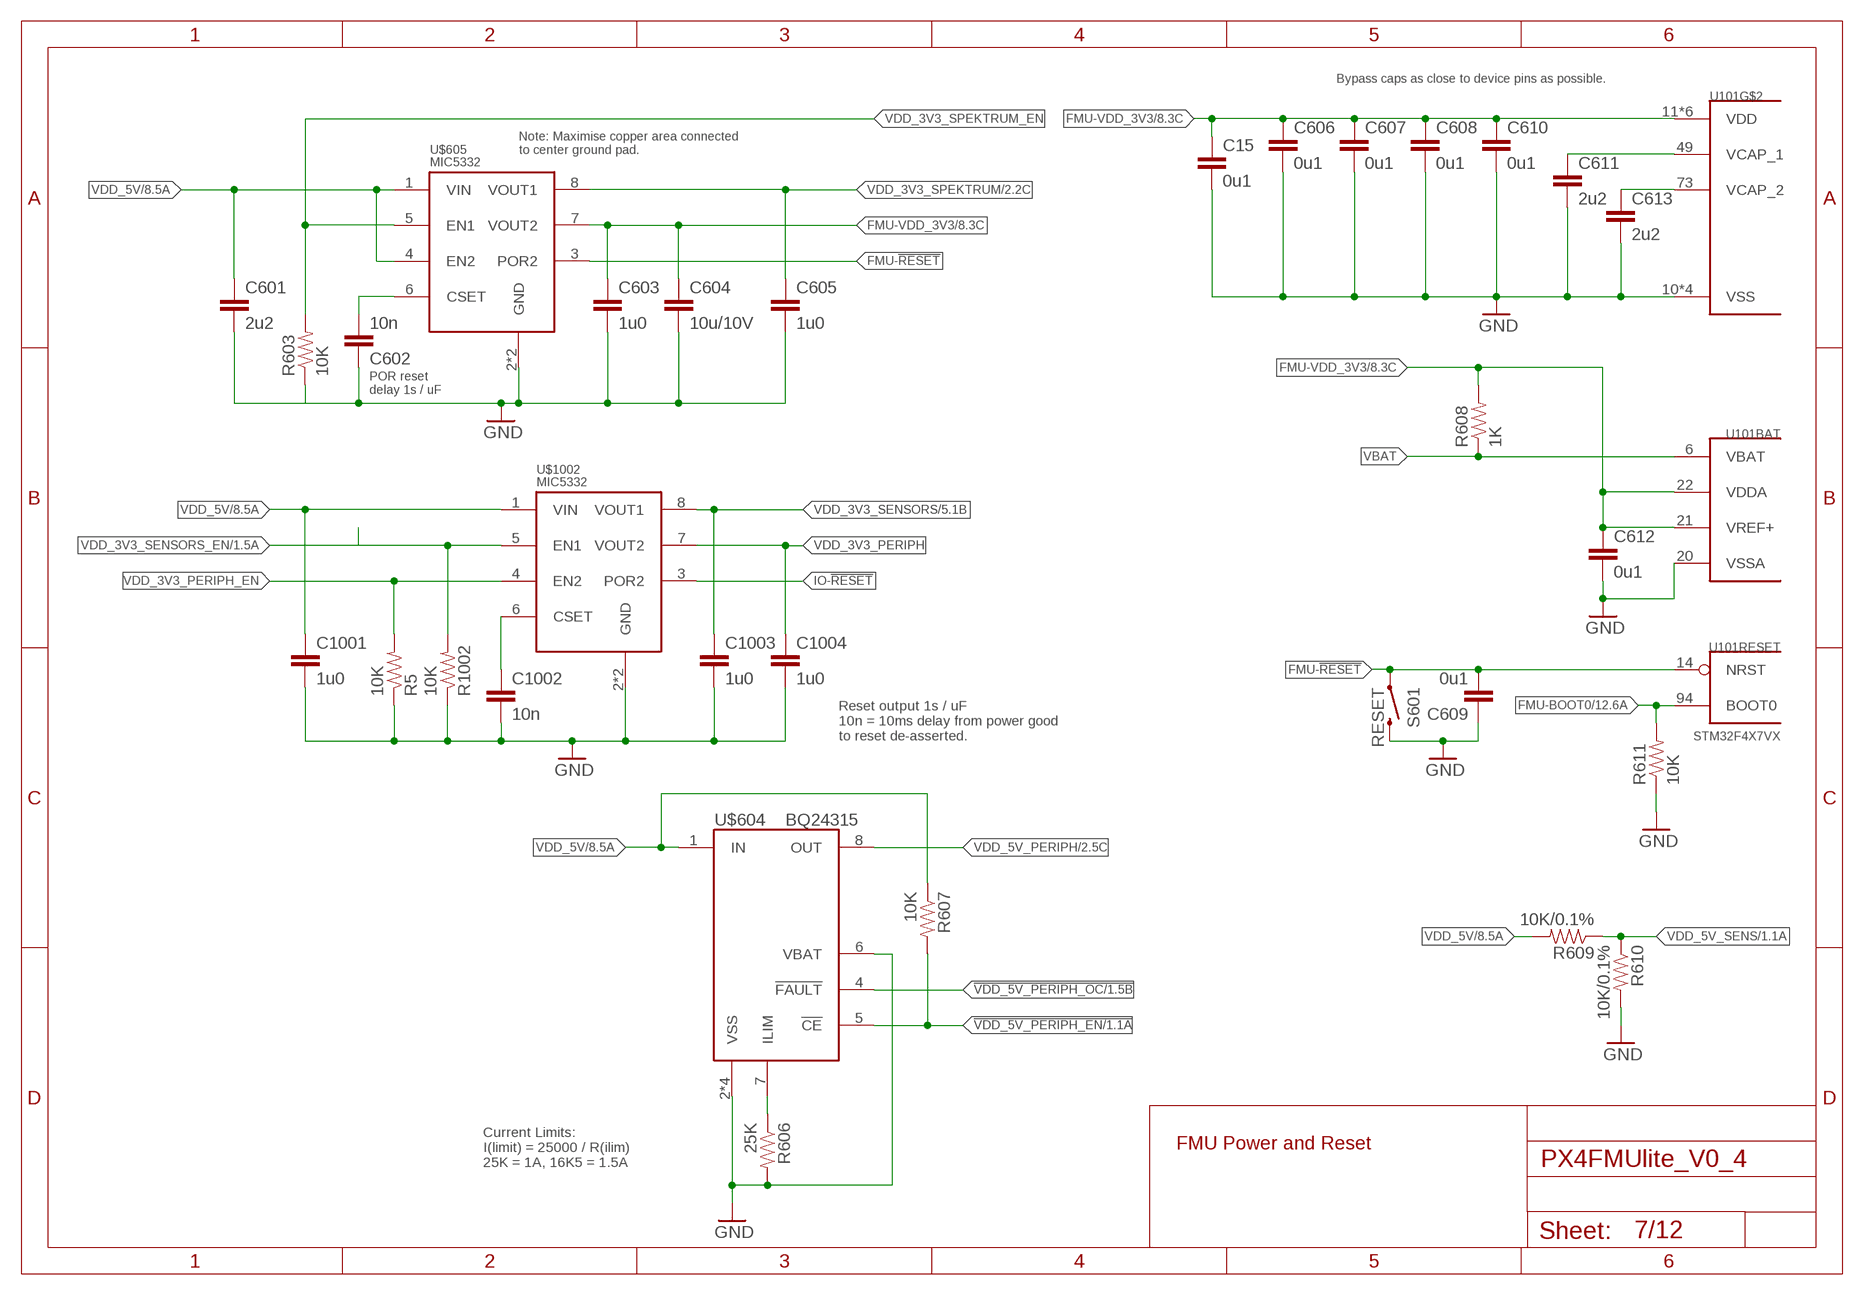
[diagram p6: schematic, sheet 7]

### Parts
C15  0u1  CAP0402  [0402-CAP]
C601  2u2  CAP0603  [0603-CAP]
C602  10n  CAP0402  [0402-CAP]
C603  1u0  CAP0603  [0603-CAP]
C604  10u/10V  CAP0805  [0805-CAP]
C605  1u0  CAP0603  [0603-CAP]
C606  0u1  CAP0402  [0402-CAP]
C607  0u1  CAP0402  [0402-CAP]
C608  0u1  CAP0402  [0402-CAP]
C609  0u1  CAP0402  [0402-CAP]
C610  0u1  CAP0402  [0402-CAP]
C611  2u2  CAP0603  [0603-CAP]
C612  0u1  CAP0402  [0402-CAP]
C613  2u2  CAP0603  [0603-CAP]
C1001  1u0  CAP0603  [0603-CAP]
C1002  10n  CAP0402  [0402-CAP]
C1003  1u0  CAP0603  [0603-CAP]
C1004  1u0  CAP0603  [0603-CAP]
R5  10K  RESISTOR0402-RES  [0402-RES]
R603  10K  RESISTOR0402-RES  [0402-RES]
R606  25K  RESISTOR0402-RES  [0402-RES]
R607  10K  RESISTOR0402-RES  [0402-RES]
R608  1K  RESISTOR0402-RES  [0402-RES]
R609  10K/0.1%  RESISTOR0402-RES  [0402-RES]
R610  10K/0.1%  RESISTOR0402-RES  [0402-RES]
R611  10K  RESISTOR0402-RES  [0402-RES]
R1002  10K  RESISTOR0402-RES  [0402-RES]
S601  RESET  SWITCH-MOMENTARY-2  [EVQP7J01K]
U$604  BQ24315  [QFN8-DSG]
U$605  MIC5332  [MLF-8-EPAD]
U$1002  MIC5332  [MLF-8-EPAD]

### Nets
!VDD_5V_PERIPH_EN: R607.P$2 U$604.5(!CE) ; also sheet 1
!VDD_5V_PERIPH_OC: U$604.4(!FAULT) ; also sheet 1
FMU-!RESET: C609.P$2 S601.A1 U101.14(RESET:NRST) U$605.3(POR2)
FMU-BOOT0: R611.P$2 U101.94(RESET:BOOT0) ; also sheet 12
FMU-VDD_3V3 [power]: C15.P$1 C603.P$1 C604.P$1 C606.P$1 C607.P$1 C608.P$1 C610.P$1 C612.P$1 R608.P$2 U101.11(VDD) U101.19(VDD) U101.21(BAT:VREF+) U101.22(BAT:VDDA) U101.28(VDD) U101.50(VDD) U101.75(VDD) U101.100(VDD) U$605.7(VOUT2) ; also sheet 3,4,8
GND [power]: C15.P$2 C601.P$2 C602.P$1 C603.P$2 C604.P$2 C605.P$2 C606.P$2 C607.P$2 C608.P$2 C609.P$1 C610.P$2 C611.P$2 C612.P$2 C613.P$2 C1001.P$2 C1002.P$2 C1003.P$2 C1004.P$2 R5.P$1 R603.P$1 R606.P$2 R610.P$2 R611.P$1 R1002.P$1 S601.B3 U101.10(VSS) U101.20(BAT:VSSA) U101.27(VSS) U101.74(VSS) U101.99(VSS) U$604.2(VSS) U$604.6(VBAT) U$604.GND(VSS) U$604.P$2(VSS) U$604.P$3(VSS) U$605.2(GND) U$605.GND U$1002.2(GND) U$1002.GND ; also sheet 1,2,3,4,5,6,8,9,10
IO-!RESET: U$1002.3(POR2)
N$8: C613.P$1 U101.73(VCAP_2)
N$11: C602.P$2 U$605.6(CSET)
N$12: C611.P$1 U101.49(VCAP_1)
N$34: R606.P$1 U$604.7(ILIM)
N$104: C1002.P$1 U$1002.6(CSET)
VBAT: R608.P$1 U101.6(BAT:VBAT)
VDD_3V3_PERIPH [power]: C1004.P$1 U$1002.7(VOUT2)
VDD_3V3_PERIPH_EN [power]: R5.P$2 U$1002.4(EN2)
VDD_3V3_SENSORS [power]: C1003.P$1 U$1002.8(VOUT1) ; also sheet 5
VDD_3V3_SENSORS_EN: R1002.P$2 U$1002.5(EN1) ; also sheet 1
VDD_3V3_SPEKTRUM [power]: C605.P$1 U$605.8(VOUT1) ; also sheet 2
VDD_3V3_SPEKTRUM_EN: R603.P$2 U$605.5(EN1)
VDD_5V [power]: C601.P$1 C1001.P$1 R607.P$1 R609.P$2 U$604.1(IN) U$605.1(VIN) U$605.4(EN2) U$1002.1(VIN) ; also sheet 6,8
VDD_5V_PERIPH [power]: U$604.8(OUT) ; also sheet 2,4
VDD_5V_SENS: R609.P$1 R610.P$1 ; also sheet 1

### Notes on the sheet
- Bypass caps as close to device pins as possible.
- Note: Maximise copper area connected 
  to center ground pad.
- POR reset 
  delay 1s / uF
- Reset output 1s / uF
  10n = 10ms delay from power good
  to reset de-asserted.
- FMU Power and Reset
- Current Limits:
  I(limit) = 25000 / R(ilim)
  25K = 1A, 16K5 = 1.5A

## Sheet 8 of 12
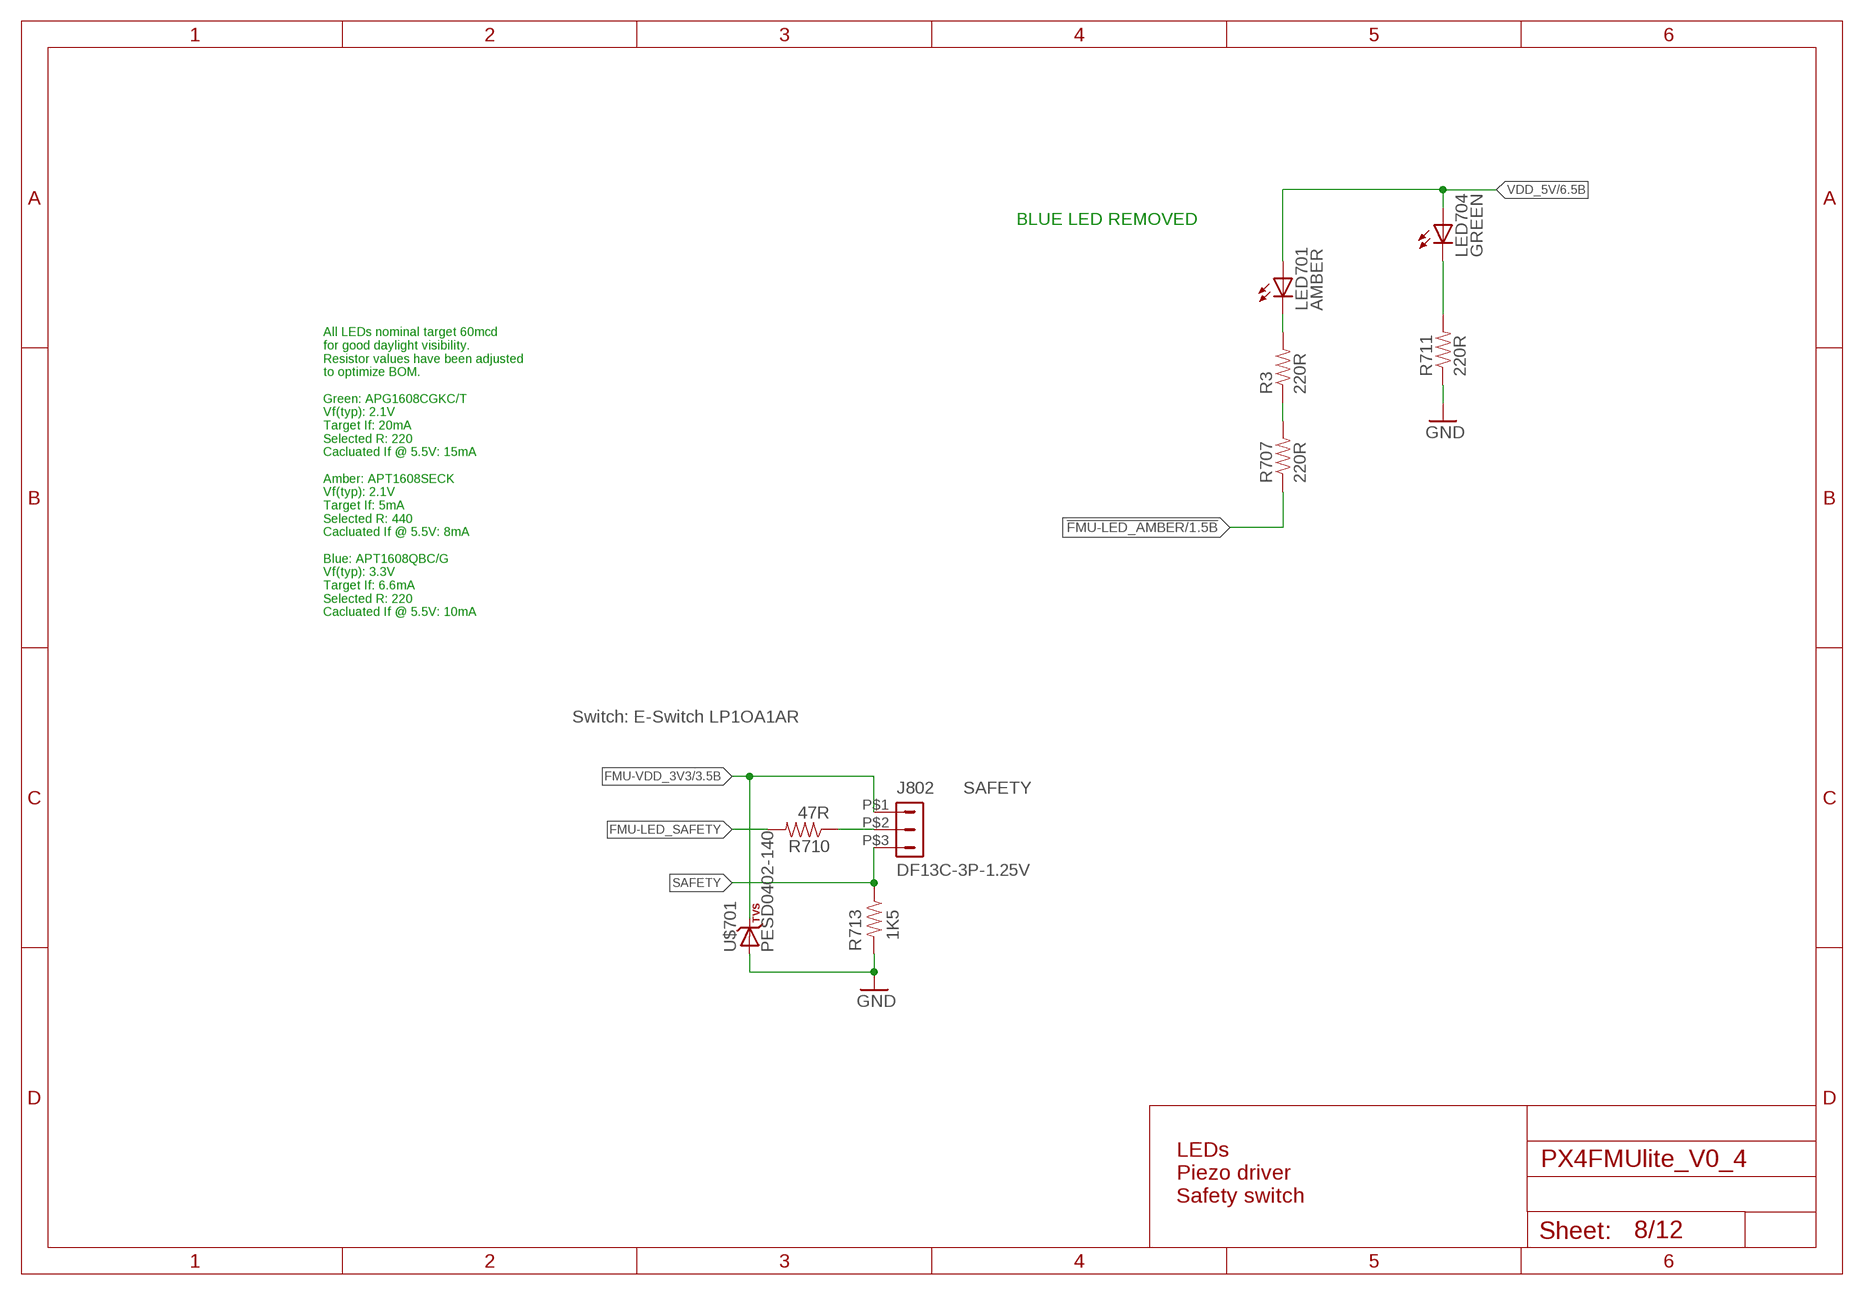
[diagram p7: schematic, sheet 8]

### Parts
J802  DF13C-3P-1.25V  DF13-3P-1.25V  [DF13C-3P-1.25V]
LED701  AMBER  LED0603  [0603-LED]
LED704  GREEN  LED0603  [0603-LED]
R3  220R  RESISTOR0402-RES  [0402-RES]
R707  220R  RESISTOR0402-RES  [0402-RES]
R710  47R  RESISTOR0402-RES  [0402-RES]
R711  220R  RESISTOR0402-RES  [0402-RES]
R713  1K5  RESISTOR0402-RES  [0402-RES]
U$701  PESD0402-140  DIODE-TVS  [0402-TVS]

### Nets
!FMU-LED_AMBER: R707.P$1 ; also sheet 1
FMU-LED_SAFETY: R710.P$2
FMU-VDD_3V3 [power]: J802.P$1 U$701.C ; also sheet 3,4,7
GND [power]: R711.P$1 R713.P$2 U$701.A ; also sheet 1,2,3,4,5,6,7,9,10
N$7: LED704.C R711.P$2
N$13: R3.P$1 R707.P$2
N$26: LED701.C R3.P$2
N$57: J802.P$2 R710.P$1
SAFETY: J802.P$3 R713.P$1
VDD_5V [power]: LED701.A LED704.A ; also sheet 6,7

### Notes on the sheet
- BLUE LED REMOVED
- All LEDs nominal target 60mcd
  for good daylight visibility.
  Resistor values have been adjusted
  to optimize BOM.
  
  Green: APG1608CGKC/T
  Vf(typ): 2.1V
  Target If: 20mA
  Selected R: 220
  Cacluated If @ 5.5V: 15mA
  
  Amber: APT1608SECK
  Vf(typ): 2.1V
  Target If: 5mA
  Selected R: 440
  Cacluated If @ 5.5V: 8mA
  
  Blue: APT1608QBC/G
  Vf(typ): 3.3V
  Target If: 6.6mA
  Selected R: 220
  Cacluated If @ 5.5V: 10mA
- Switch: E-Switch LP1OA1AR
- SAFETY
- LEDs
  Piezo driver
  Safety switch

## Sheet 9 of 12
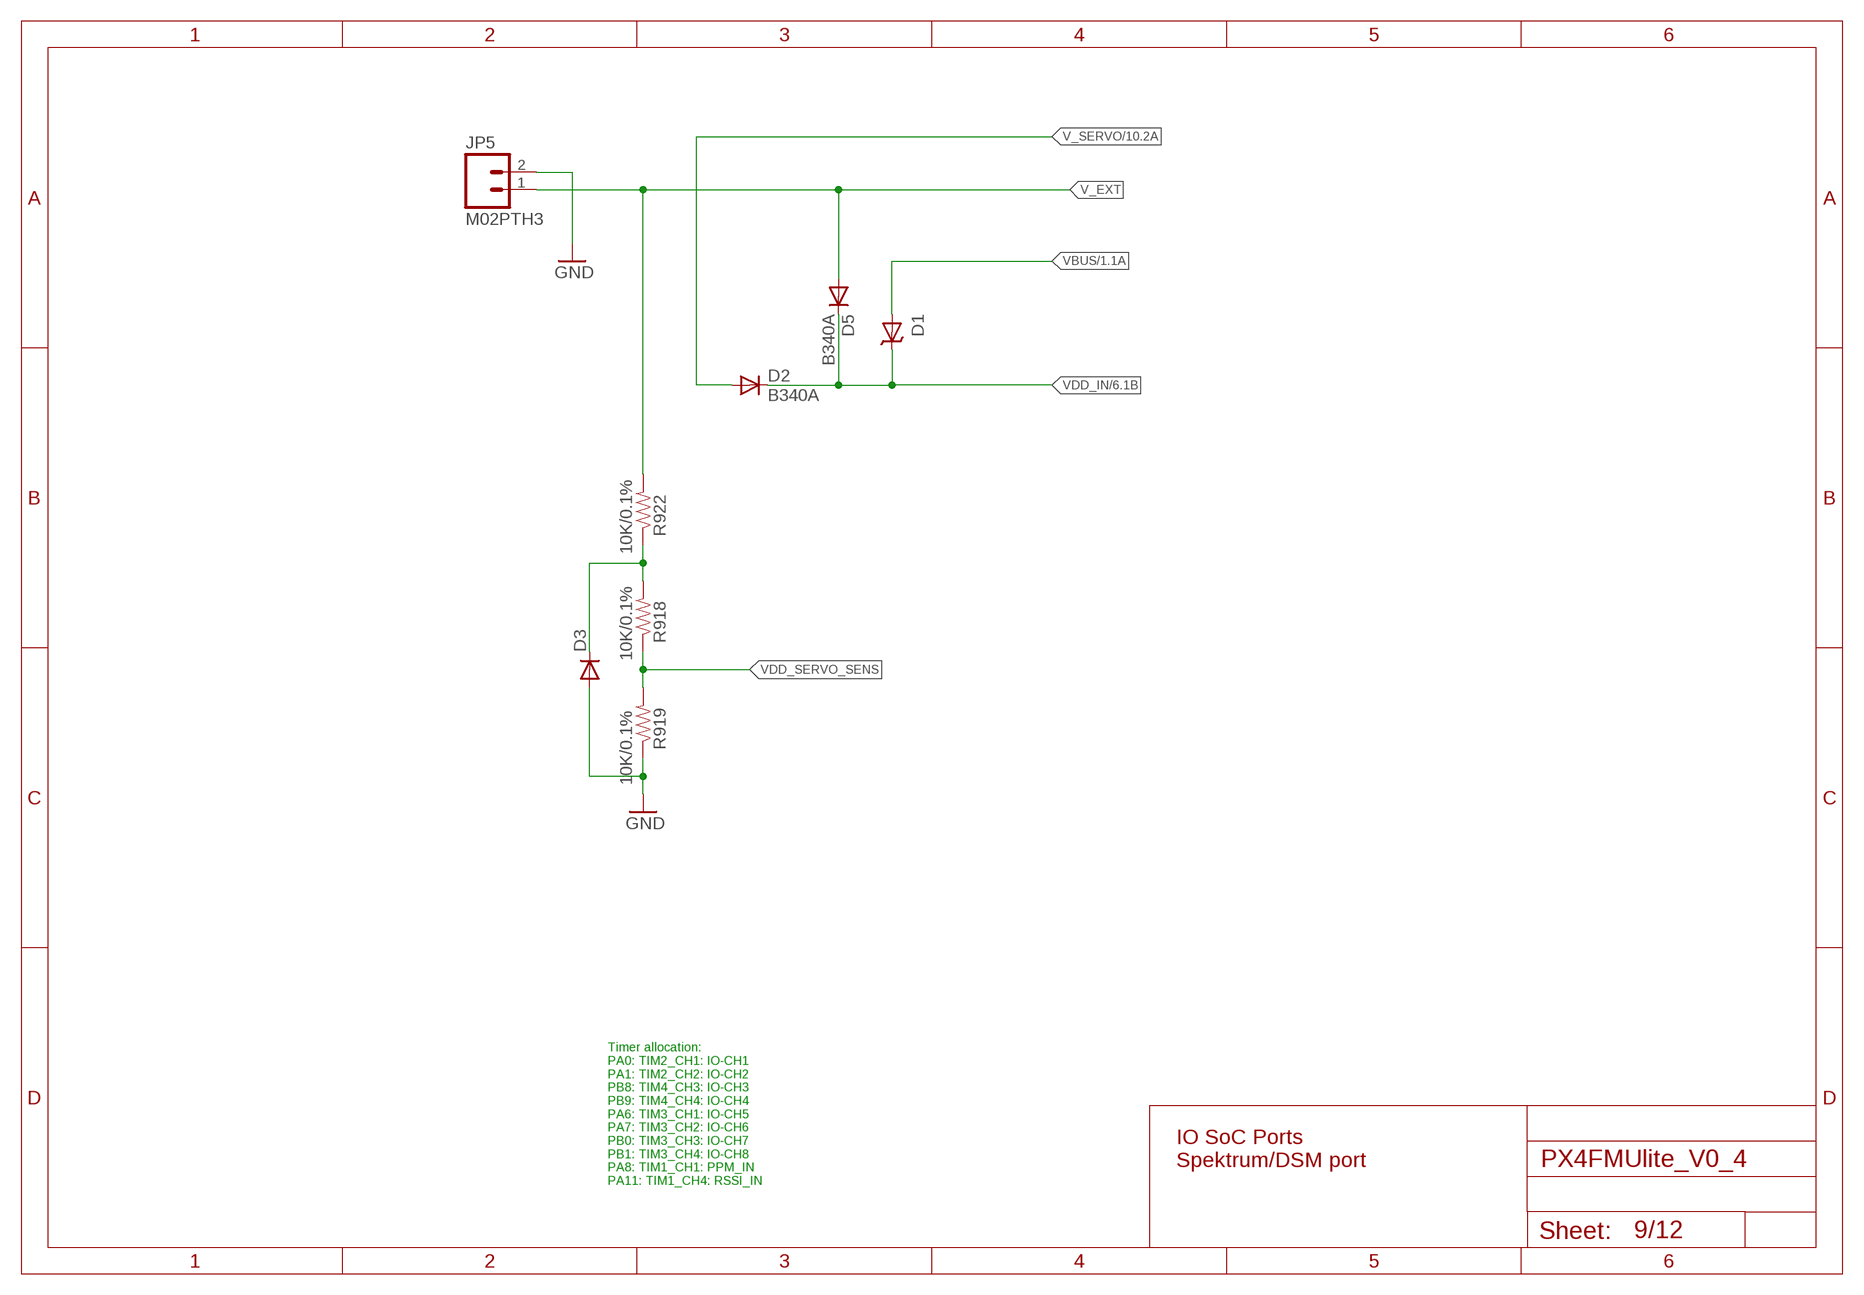
[diagram p8: schematic, sheet 9]

### Parts
D1  MSS1P4-M3  DIODE-SCHOTTKY_MSMP  [MICROSMP]
D2  B340A  DIODESMA  [SMA-DIODE]
D3  DIODESOD  [SOD-323]
D5  B340A  DIODESMA  [SMA-DIODE]
JP5  M02PTH3  [1X02_LONGPADS]
R918  10K/0.1%  RESISTOR0402-RES  [0402-RES]
R919  10K/0.1%  RESISTOR0402-RES  [0402-RES]
R922  10K/0.1%  RESISTOR0402-RES  [0402-RES]

### Nets
GND [power]: D3.2(A) JP5.2 R919.P$1 ; also sheet 1,2,3,4,5,6,7,8,10
N$6: D3.1(C) R918.P$2 R922.P$1
V_EXT [power]: D5.A JP5.1 R922.P$2
V_SERVO [power]: D2.A ; also sheet 10
VBUS [power]: D1.ANODE(A) ; also sheet 1,3
VDD_IN [power]: D1.CATHODE(C) D2.C D5.C ; also sheet 6
VDD_SERVO_SENS: R918.P$1 R919.P$2

### Notes on the sheet
- IO SoC Ports
  Spektrum/DSM port
- Timer allocation:
  PA0: TIM2_CH1: IO-CH1
  PA1: TIM2_CH2: IO-CH2
  PB8: TIM4_CH3: IO-CH3
  PB9: TIM4_CH4: IO-CH4
  PA6: TIM3_CH1: IO-CH5
  PA7: TIM3_CH2: IO-CH6
  PB0: TIM3_CH3: IO-CH7
  PB1: TIM3_CH4: IO-CH8
  PA8: TIM1_CH1: PPM_IN
  PA11: TIM1_CH4: RSSI_IN

## Sheet 10 of 12
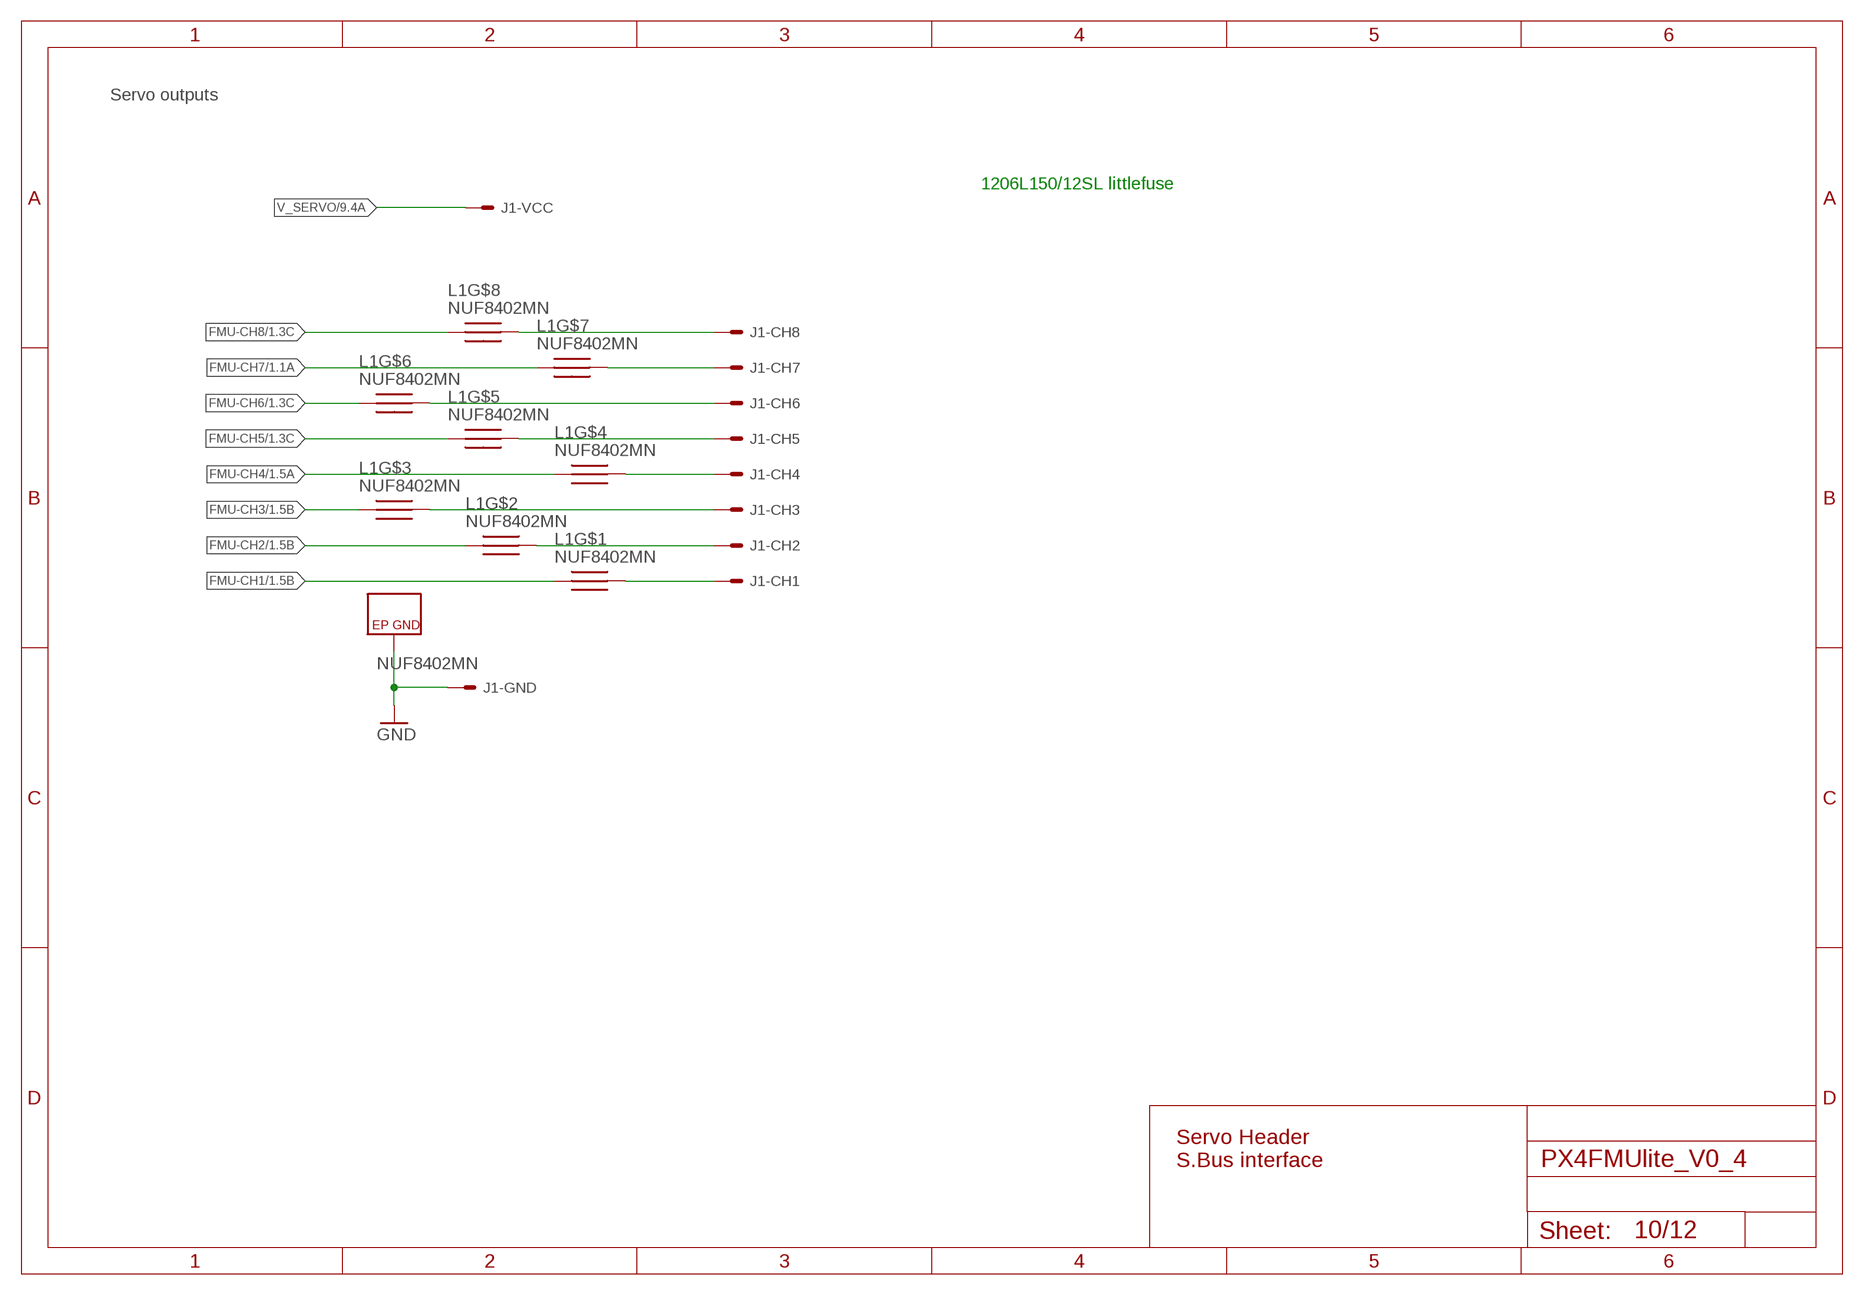
[diagram p9: schematic, sheet 10]

### Parts
J1  SERVO_HEADER-3X8  [3X8RA_SERVO]
L1  NUF8402MN  [DFN16-THIN]

### Nets
FMU-CH1: L1.P$1 ; also sheet 1
FMU-CH1-PROT: J1.S1 L1.P$16
FMU-CH2: L1.P$2 ; also sheet 1
FMU-CH3: L1.P$3 ; also sheet 1
FMU-CH4: L1.P$4 ; also sheet 1
FMU-CH5: L1.P$5 ; also sheet 1
FMU-CH6: L1.P$6 ; also sheet 1
FMU-CH7: L1.P$7 ; also sheet 1
FMU-CH8: L1.P$8 ; also sheet 1
GND [power]: J1.GND_S1 J1.GND_S2 J1.GND_S3 J1.GND_S4 J1.GND_S5 J1.GND_S6 J1.GND_S7 J1.GND_S8 L1.P$EP(GND) ; also sheet 1,2,3,4,5,6,7,8,9
N$15: J1.S8 L1.P$9
N$16: J1.S7 L1.P$10
N$36: J1.S6 L1.P$11
N$68: J1.S5 L1.P$12
N$77: J1.S4 L1.P$13
N$78: J1.S3 L1.P$14
N$79: J1.S2 L1.P$15
V_SERVO [power]: J1.PWR_S1 J1.PWR_S2 J1.PWR_S3 J1.PWR_S4 J1.PWR_S5 J1.PWR_S6 J1.PWR_S7 J1.PWR_S8 ; also sheet 9

### Notes on the sheet
- Servo outputs
- 1206L150/12SL littlefuse
- Servo Header
  S.Bus interface

## Sheet 11 of 12
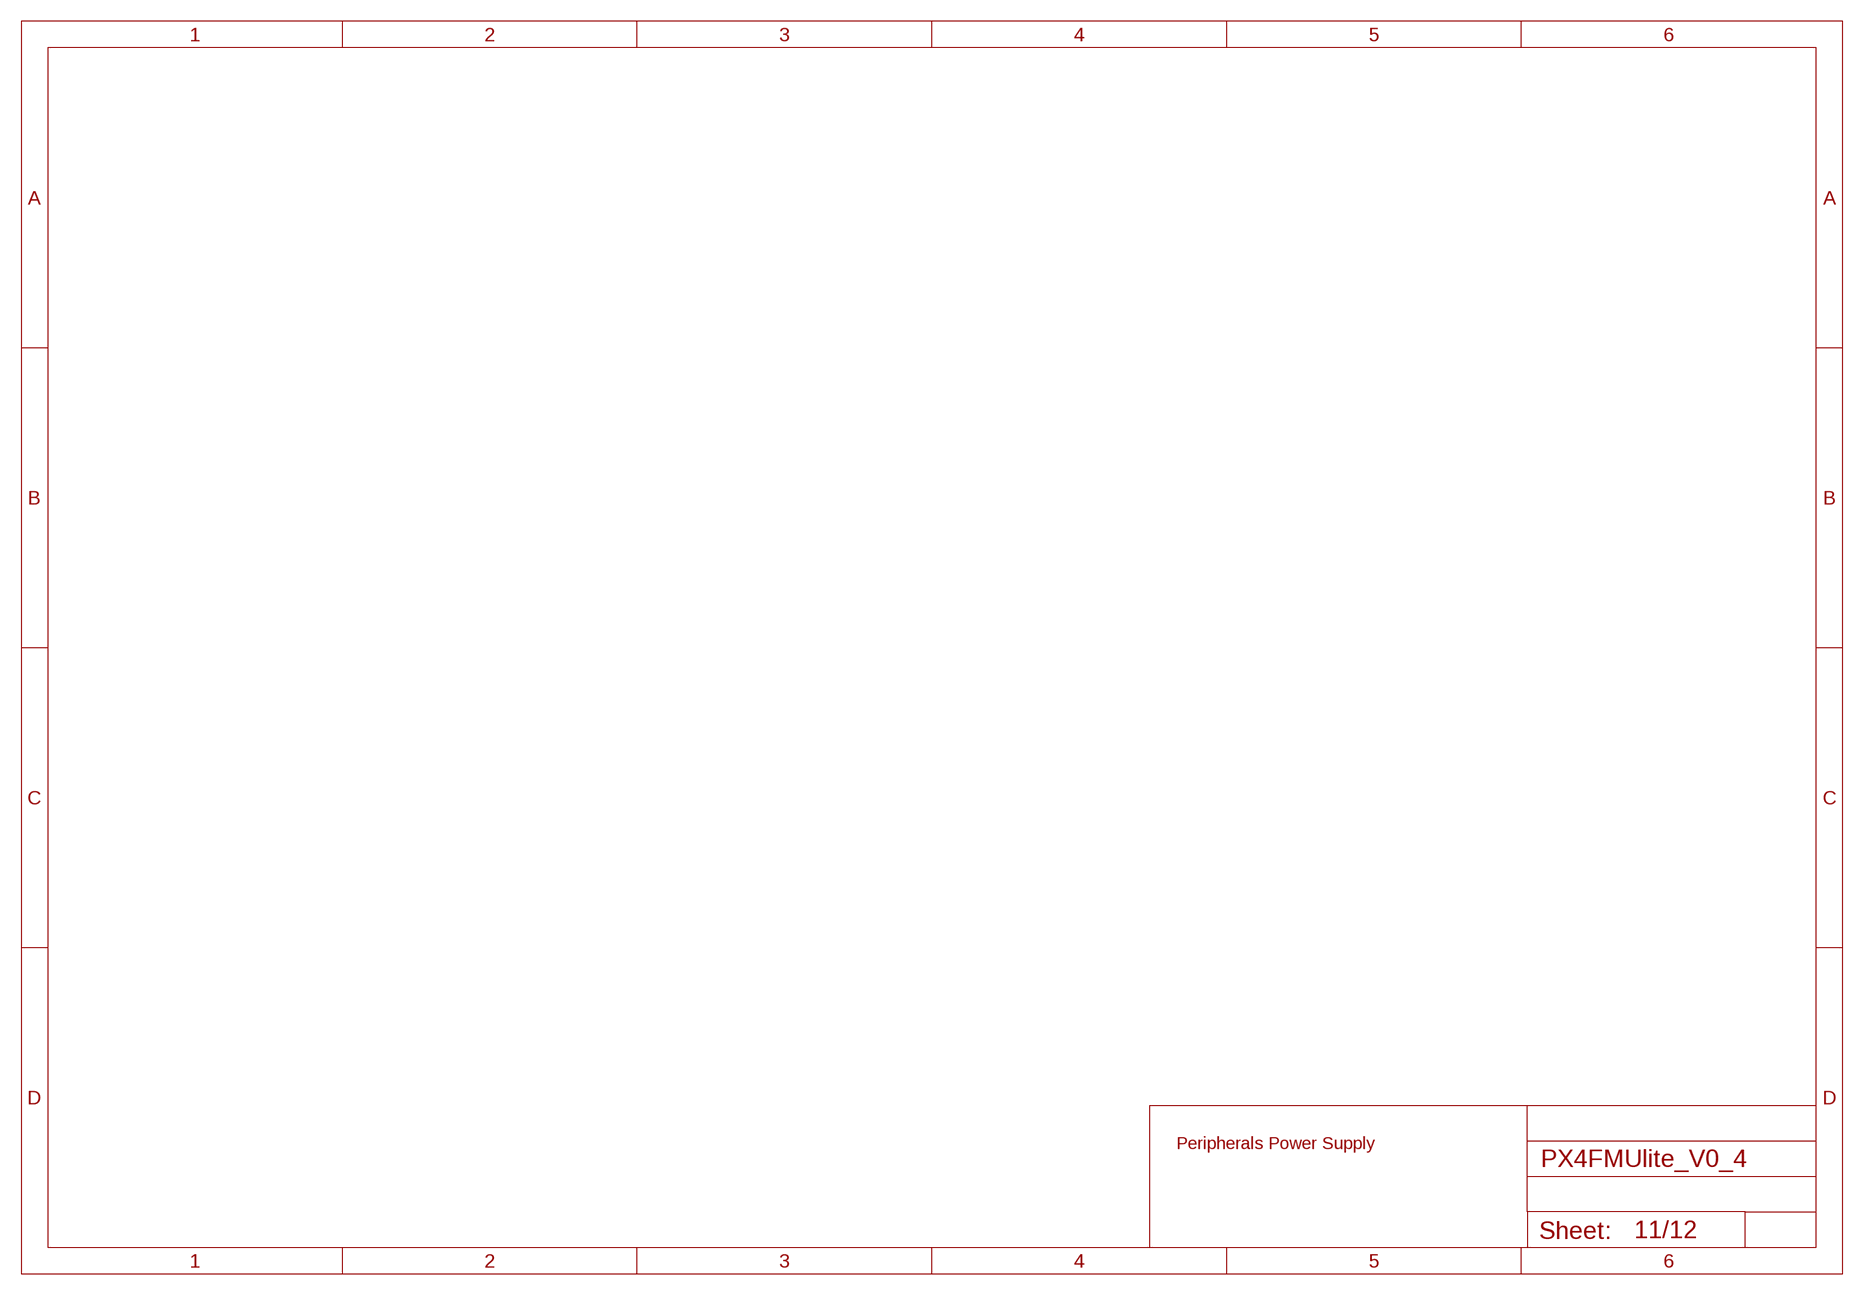
[diagram p10: schematic, sheet 11]

### Notes on the sheet
- Peripherals Power Supply

## Sheet 12 of 12
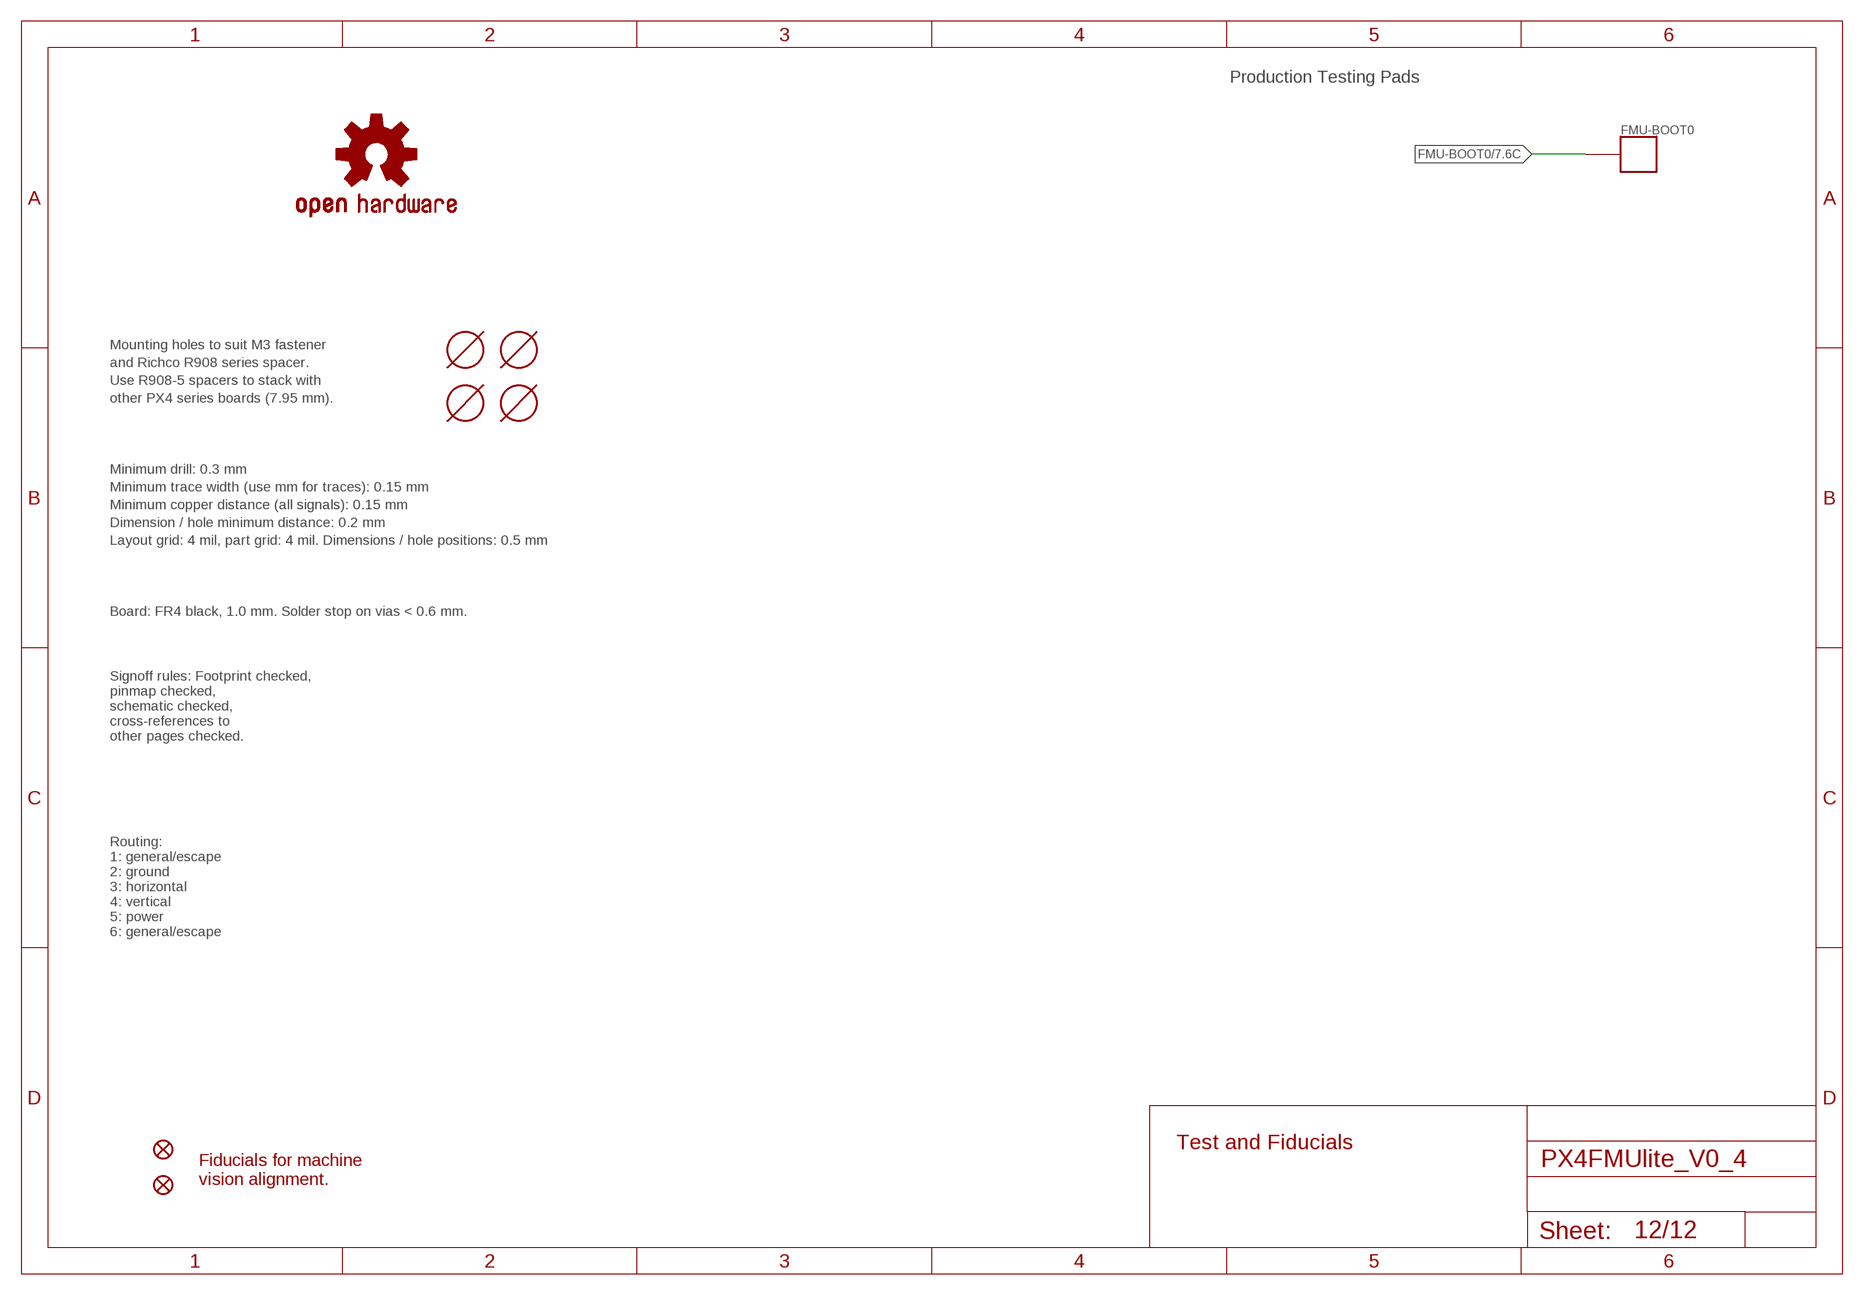
[diagram p11: schematic, sheet 12]

### Parts
FMU-BOOT0  PAD.04  [PAD.04X.04]
JP1  FIDUCIAL1.5X3  [FIDUCIAL-1.5X3]
JP2  FIDUCIAL1.5X3  [FIDUCIAL-1.5X3]
M3_MOUNT1101  MOUNT-HOLE3.1MM  [MOUNT-HOLE3.1]
M3_MOUNT1102  MOUNT-HOLE3.1MM  [MOUNT-HOLE3.1]
M3_MOUNT1103  MOUNT-HOLE3.1MM  [MOUNT-HOLE3.1]
M3_MOUNT1104  MOUNT-HOLE3.1MM  [MOUNT-HOLE3.1]
OSHW_LOGO  OSHW-LOGOS  [OSHW-LOGO-S]

### Nets
FMU-BOOT0: FMU-BOOT0.P$1 ; also sheet 7

### Notes on the sheet
- Production Testing Pads
- Mounting holes to suit M3 fastener
- and Richco R908 series spacer.
- Use R908-5 spacers to stack with
- other PX4 series boards (7.95 mm).
- Minimum drill: 0.3 mm
- Minimum trace width (use mm for traces): 0.15 mm
- Minimum copper distance (all signals): 0.15 mm
- Dimension / hole minimum distance: 0.2 mm
- Layout grid: 4 mil, part grid: 4 mil. Dimensions / hole positions: 0.5 mm
- Board: FR4 black, 1.0 mm. Solder stop on vias < 0.6 mm.
- Signoff rules: Footprint checked,
  pinmap checked,
  schematic checked, 
  cross-references to
  other pages checked.
- Routing:
  1: general/escape
  2: ground
  3: horizontal
  4: vertical
  5: power
  6: general/escape
- Test and Fiducials
- Fiducials for machine
  vision alignment.

## Library data of the parts
C1 C8-C10 = SparkFun-Capacitors:22UF-16V-20%-(1210): CAP-10381; PROD_ID: CAP-10381
C2-C7 C12 C14 C15 C402 C606-C610 C612 = pixhawk2:CAP: Capacitor Standard 0603 ceramic capacitor, and 0.1" leaded capacitor.; PARTNO: CC0402ZRY5V7BB104
C13 C601 C611 C613 = pixhawk2:CAP: Capacitor Standard 0603 ceramic capacitor, and 0.1" leaded capacitor.; PARTNO: C1608Y5V1C225Z
C102 C103 = pixhawk2:CAP: Capacitor Standard 0603 ceramic capacitor, and 0.1" leaded capacitor.; PARTNO: C1005C0G1H080C
C505 C602 C1002 = pixhawk2:CAP: Capacitor Standard 0603 ceramic capacitor, and 0.1" leaded capacitor.; PARTNO: CC0402KRX7R7BB103
C506 C604 = pixhawk2:CAP: Capacitor Standard 0603 ceramic capacitor, and 0.1" leaded capacitor.; PARTNO: CC0805ZKY5V6BB106
C603 C605 C1001 C1003 C1004 = pixhawk2:CAP: Capacitor Standard 0603 ceramic capacitor, and 0.1" leaded capacitor.; PARTNO: CC0603ZRY5V7BB105
D1 = pixhawk2:DIODE-SCHOTTKY: Schottky barrier diode in DO214AC, e.g. Fairchild SS14.; PARTNO: MSS1P4-M3/89A
D2 D5 = SparkFun-DiscreteSemi:DIODE: Diode These are standard reverse protection diodes and small signal diodes. SMA package can handle up to about 1A. SOD-323 can handle about 200mA. What the SOD-323 package when ordering, there are some mfgs out there that are 5-pin packages.
D3 = SparkFun-DiscreteSemi:DIODE: Diode These are standard reverse protection diodes and small signal diodes. SMA package can handle up to about 1A. SOD-323 can handle about 200mA. What the SOD-323 package when ordering, there are some mfgs out there that are 5-pin packages.; PROD_ID: DIO-09646
FMU-BOOT0 = pixhawk2:PAD: Test pad This footprint includes three classes: The actual test pads, a pogo-pin footprint to mount the pogo-pin as through-hole part and a hole footprint which allows the head of the pogo-pin to pass through (do NOT use the hole to mount the pogo-pin). In a typical test setup, the stack would consist of three PCBs: The actual PCB under testing with a test pad on the bottom, then a second PCB with the hole for the pogo-pin head where the PCB under testing is pressed on and a third PCB at 30 mm / 1.2" distance with the pogo-pin footprints. The pogo-pins are soldered to the last PCB. To create the stack, copy the board under testing and exchange the footprints - this way the correct positioning is ensured.; BOM: EXCLUDE; PARTNO: *
J1 = PX4lite:SERVO_HEADER-3X8: 3x10 servo header
J2 J3 J302 J401 J405 = con-hirose-df13:DF13-4P-1.25: DF13-4P 1.25mm Pitch Miniature Crimping Connector.; PARTNO: DF13C-4P-1.25V(20)
J201-J203 = con-hirose-df13:DF13-6P-1.25: DF13-6P 1.25mm Pitch Miniature Crimping Connector.; PARTNO: DF13C-6P-1.25V(20)
J403 = con-hirose-df13:DF13-7P-1.25: DF13-7P 1.25mm Pitch Miniature Crimping Connector.; PARTNO: DF13C-7P-1.25V(20)
J802 = con-hirose-df13:DF13-3P-1.25: DF13-3P 1.25mm Pitch Miniature Crimping Connector.; PARTNO: DF13C-3P-1.25V(20)
JP1 JP2 = pixhawk2:FIDUCIAL: Fiducial Alignment Points Various fiducial points for machine vision alignment.; BOM: EXCLUDE; PARTNO: *
JP5 = SparkFun-Connectors:M02: Standard 2-pin 0.1" header. Use with - straight break away headers ( PRT-00116) - right angle break away headers (PRT-00553) - swiss pins (PRT-00743) - machine pins (PRT-00117) - female headers (PRT-00115) Molex polarized connector foot print use with: PRT-08233 with associated crimp pins and housings. 2.54_SCREWTERM for use with PRT-10571. 3.5mm Screw Terminal footprints for PRT-08084 5mm Screw Terminal footprints for use with PRT-08433
JX301 = pixhawk2:ARM_MINI_JTAG: CONNECTOR wire to board 1.25 mm (.049 inch) pitch header; BOM: EXCLUDE; PARTNO: M50-3900542
L1-L3 L6 = PX4lite:NUF8402MN: NUF8402 OnSemi ESD and EMI filter
L4 L5 L7 L201-L203 L402 L403 = pixhawk2:KNH16C104DA5TS: Kyocera KNH16C104DA5TS EMI filter; PARTNO: KNH16C104DA5TS
LED701 = pixhawk2:LED: LEDs Standard schematic elements and footprints for 5mm, 3mm, 1206, and 0603 sized LEDs. 5mm - Spark Fun Electronics SKU : COM-00529 (and others); PARTNO: APTD1608SECK
LED704 = pixhawk2:LED: LEDs Standard schematic elements and footprints for 5mm, 3mm, 1206, and 0603 sized LEDs. 5mm - Spark Fun Electronics SKU : COM-00529 (and others); PARTNO: APTD1608CGCK
M3_MOUNT1101-M3_MOUNT1104 = pixhawk2:MOUNT-HOLE; BOM: EXCLUDE; PARTNO: *
OSHW_LOGO = pixhawk2:OSHW-LOGO: Open Source Hardware Logo This logo indicates the piece of hardware it is found on incorporates a OSHW license and/or adheres to the definition of open source hardware found here: http://freedomdefined.org/OSHW; BOM: EXCLUDE; PARTNO: *
R1 R2 R401 R402 R713 = pixhawk2:RESISTOR: Resistor Basic schematic elements and footprints for 0603, 1206, and PTH 1/10th watt (small) resistors.; PARTNO: RC0402FR-071K5L
R3 R707 R711 = pixhawk2:RESISTOR: Resistor Basic schematic elements and footprints for 0603, 1206, and PTH 1/10th watt (small) resistors.; PARTNO: RC0402FR-07220RL
R4 R409 = pixhawk2:RESISTOR: Resistor Basic schematic elements and footprints for 0603, 1206, and PTH 1/10th watt (small) resistors.; PARTNO: RC0402FR-07120RL
R5 R102 R603 R607 R611 R1002 = pixhawk2:RESISTOR: Resistor Basic schematic elements and footprints for 0603, 1206, and PTH 1/10th watt (small) resistors.; PARTNO: RC0402FR-0710KL
R407 R408 R609 R610 R918 R919 R922 = pixhawk2:RESISTOR: Resistor Basic schematic elements and footprints for 0603, 1206, and PTH 1/10th watt (small) resistors.; PARTNO: ERA-2AEB103X
R606 = pixhawk2:RESISTOR: Resistor Basic schematic elements and footprints for 0603, 1206, and PTH 1/10th watt (small) resistors.; PARTNO: RMCF0402FT25K5
R608 = pixhawk2:RESISTOR: Resistor Basic schematic elements and footprints for 0603, 1206, and PTH 1/10th watt (small) resistors.; PARTNO: RC0402FR-071KL
R710 = pixhawk2:RESISTOR: Resistor Basic schematic elements and footprints for 0603, 1206, and PTH 1/10th watt (small) resistors.; PARTNO: RC0402JR-0747RL
S601 = pixhawk2:SWITCH-MOMENTARY-2; PARTNO: EVQP7J01K
SJ1 SJ2 = SparkFun-Passives:SOLDERJUMPER: Solder Jumper Standard SMD solder jumper. Used to automate production. Two varients : Normally Open and Normally Closed are the same, but have different paste layers. NC will have a large amount of paste and should jumper during reflow.
U2 U401 = pixhawk2:MAX3051: 3.3-V CAN TRANSCEIVER; PARTNO: MAX3051EKA
U101 = pixhawk2:STM32F4X7VX: STM32F4X7VX 100 pin LQFP STM32F407VE - 512 KB flash, no crypto STM32F407VG - 1 MB flash, no crypto STM32F417VE - 512 KB flash, with crypto STM32F417VG - 1 MB flash, with crypto; PARTNO: STM32F427VI
U$1 U$14 = PX4lite:HEADER-3X1: Single row 0.1" servo header
U$2 = PX4lite:MAX21100
U$3 = PX4lite:W25Q64FV: W25Q64FV Winbond 64Mbit Flash
U$4 U$7 U$201-U$203 U$401 U$404 U$701 = pixhawk2:DIODE-TVS; PARTNO: PESD0402-140
U$5 = PX4lite:NUF2042XV6
U$15 = PX4lite:TPS6303X: TPS6303x buck-boost
U$16 = ti_tps_soln2:XFL4020-222MEB; DCR: 0.02; IDC: 3.7; L: 2.2E-6; MANUFACTURER_NAME: Coilcraft; MANUFACTURER_PART_NUMBER: XFL4020-222MEB; VENDOR: Coilcraft
U$604 = pixhawk2:BQ24315; PARTNO: BQ24315DSGR
U$605 U$1002 = pixhawk2:MIC5332; PARTNO: MIC5332-SSYMT
X101 = pixhawk2:OSCILLATOR: Crystal Oscillator in 3.2x2.5 SMD; PARTNO: NX3225SA-24.000000MHZ

## Net classes
0 signal: width 0.152 mm, drill 0.2 mm, clearance 0.152 mm
1 power: width 0.254 mm, drill 0.3 mm, clearance 0.152 mm